# EAGLE board Avionics-Test (EAGLE 9.6.2), part 1 of 2
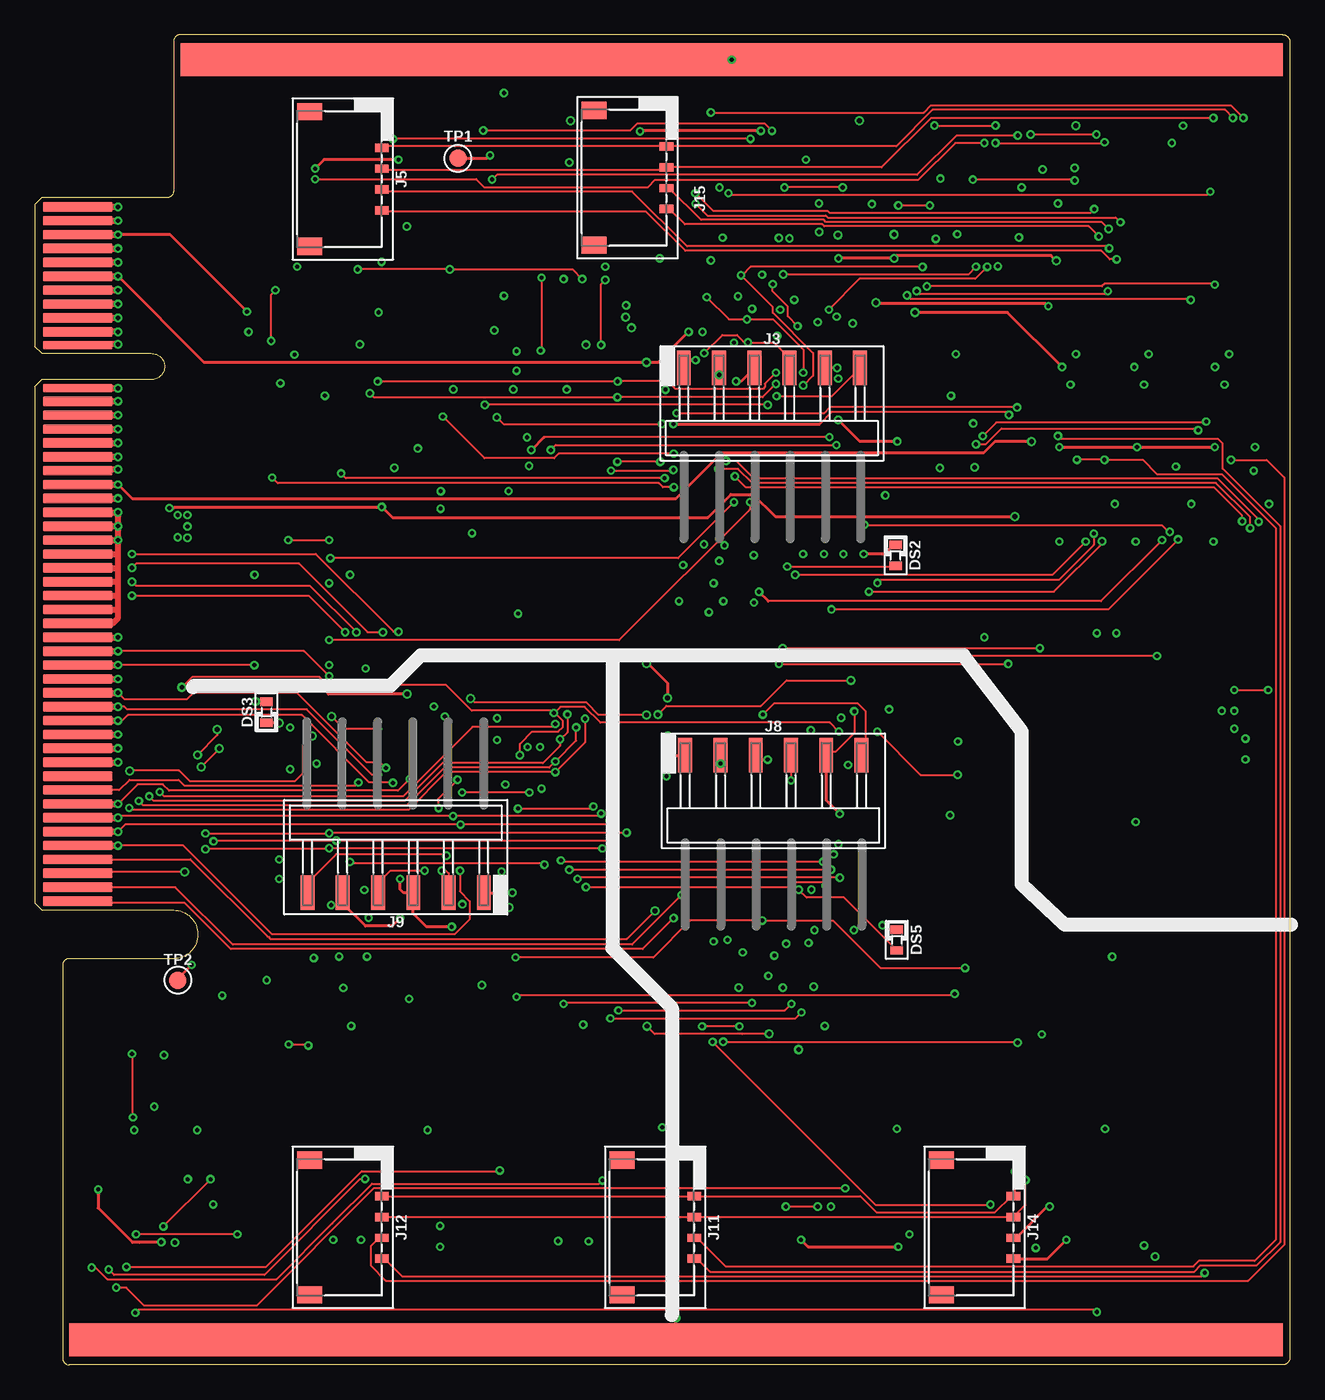
[diagram p14: board, top side]
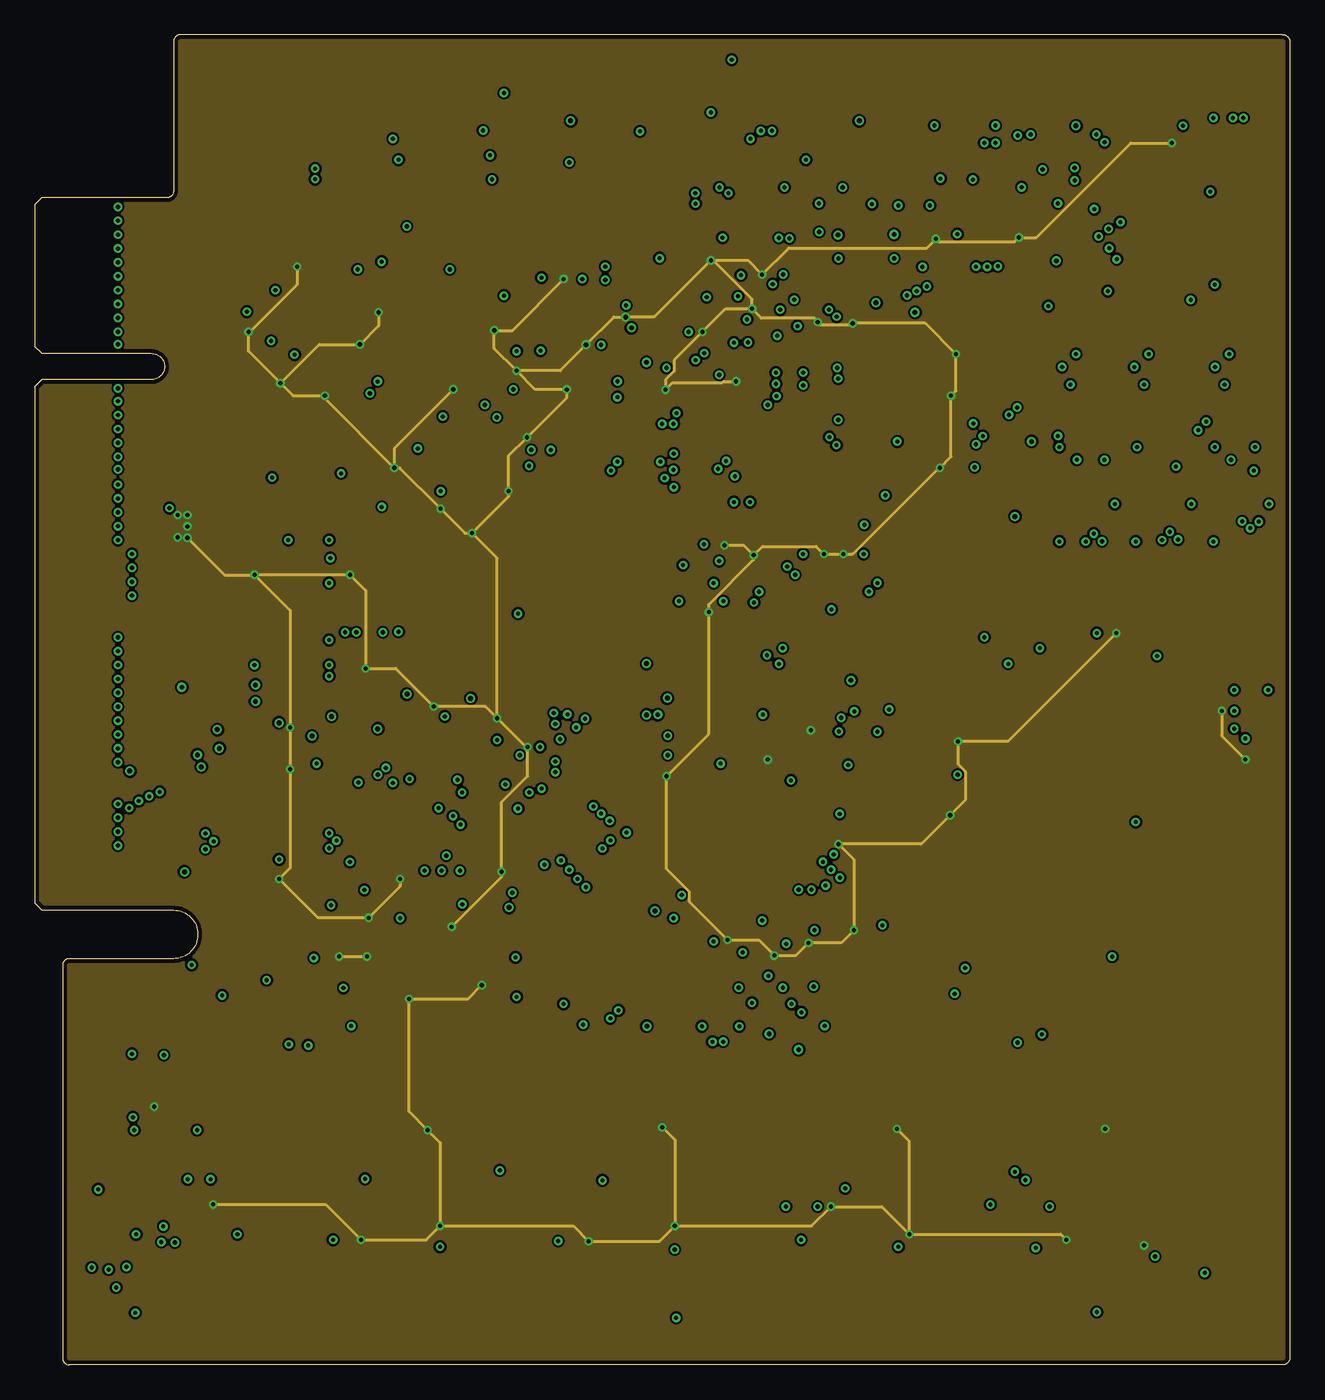
[diagram p15: board, inner layer Route2]
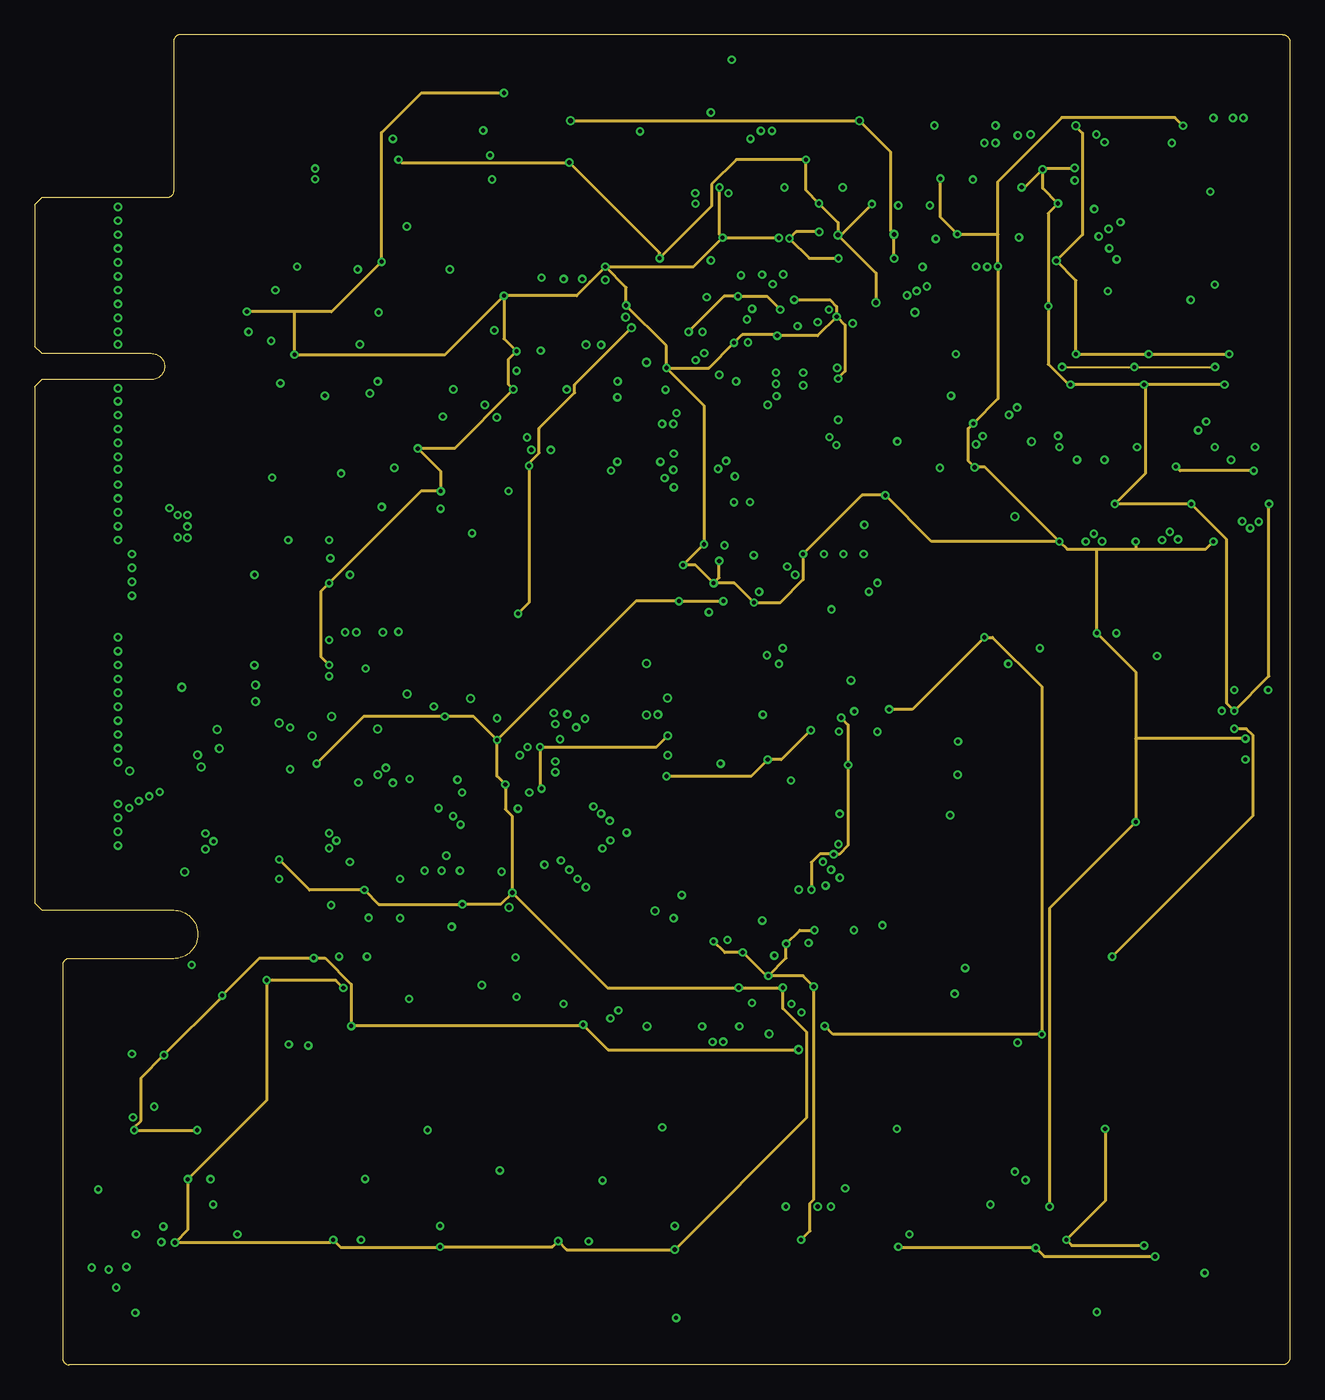
[diagram p16: board, inner layer Route15]
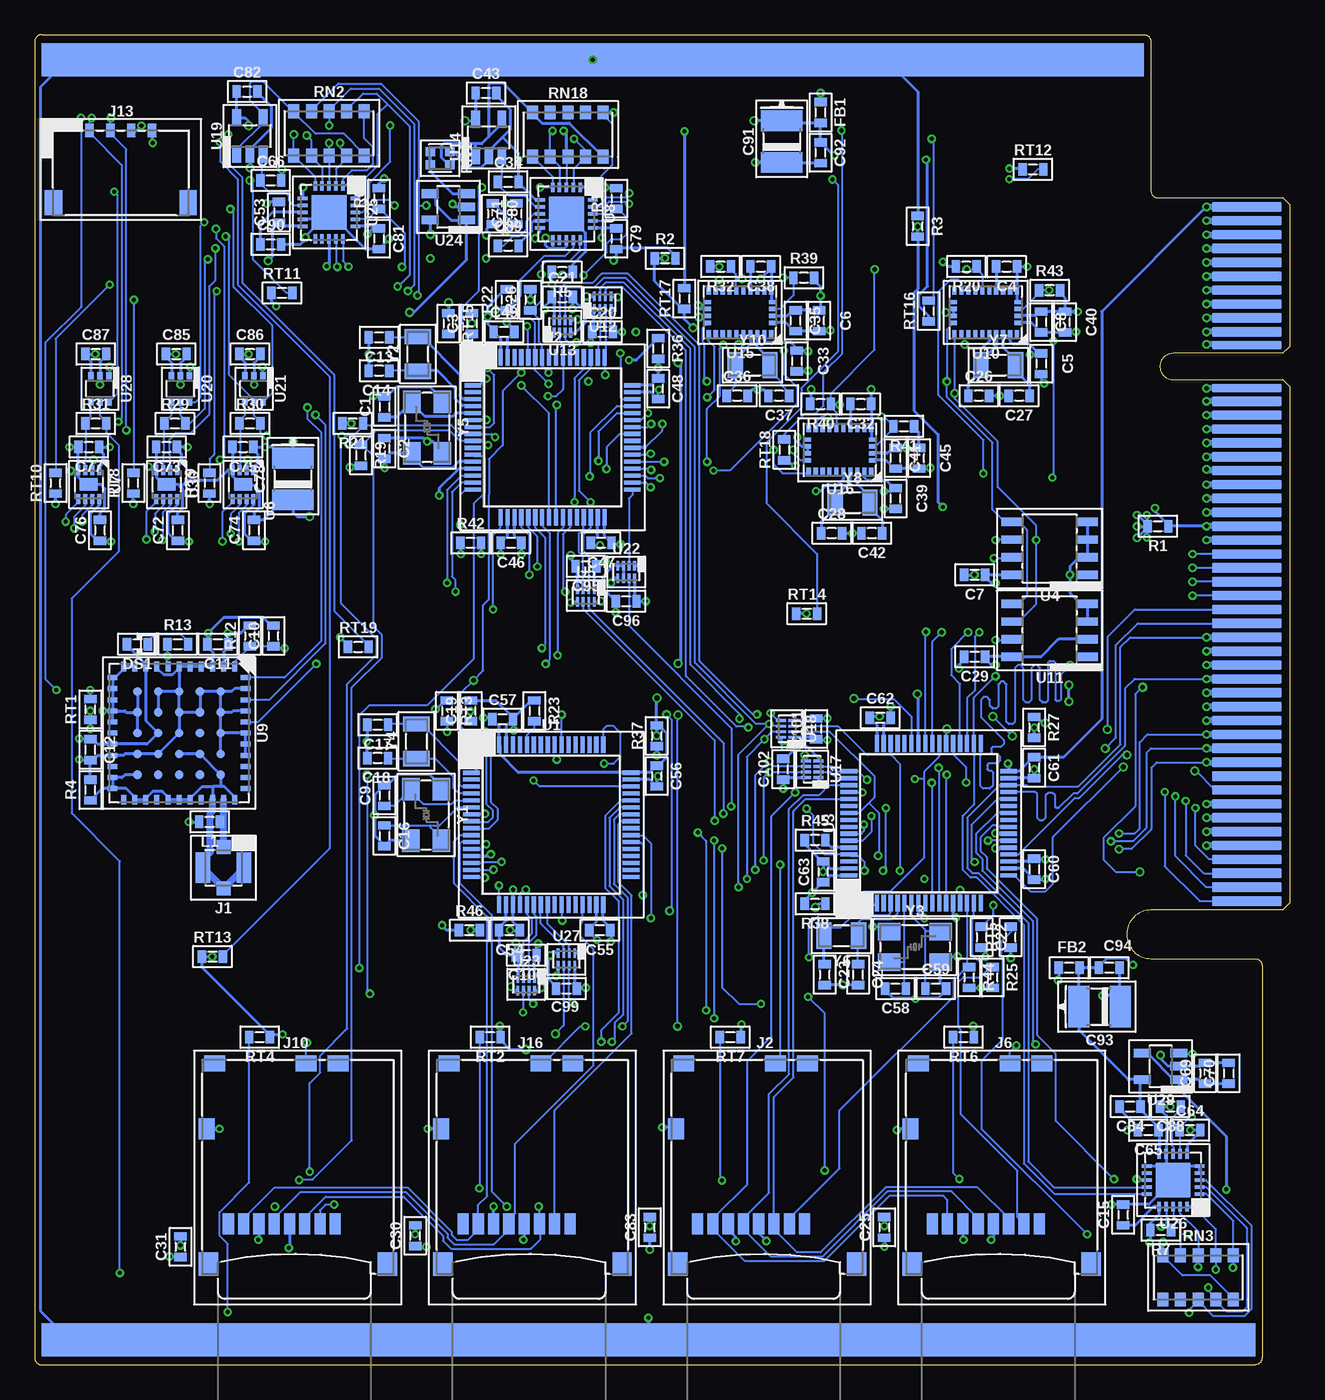
[diagram p17: board, bottom side, seen from below]

Size 90.4 x 95.8 mm. Coordinates in mm from the lower left corner, seen from the top.
Copper layers (1+2*15+16): Top 0.035mm / dielectric 1.6mm / Route2 0.035mm / dielectric 1.2mm / Route15 0.035mm / dielectric 0.2mm / Bottom 0.035mm
Design rules "CougsInSpace *": minimum track width 0.16mm, minimum drill 0.3mm, track to track 0.16mm, track to pad 0.16mm, pad to pad 0.16mm, via to via 0.16mm, smd to smd 0mil, copper to edge 0.3mm, drill to drill 0.3mm, minimum pad ring 0.15mm, minimum via ring 0.15mm, stop-mask expansion 0mil, vias tented up to drill 1mm, thermal gap 0.25mm
Net classes: 1 Power: width 0.2 mm

## Footprints (pad centres in the part's own frame; a part is rotated, then mirrored left to right if it is on the bottom)
1608 = smd 0.6 x 0.9: 1 -0.75,0; 2 0.75,0
4028-POL = smd 1.5 x 3: A 1.5,0; C -1.5,0
1608-POL = smd 0.6 x 0.9: A 0.75,0; C -0.75,0
U.FL = smd 1 x 1: CENTER 0,-1.5; SHIELD@2 0,1.5 | smd 1.05 x 2.2: SHIELD@1 -1.475,0; SHIELD@13 1.475,0
µSD-PUSH-PUSH = smd 0.8 x 1.5: CD/DAT3 5.55,-3.75; CLK 8.85,-3.75; CMD 6.65,-3.75; DAT0 11.05,-3.75; DAT1 12.15,-3.75; DAT2 4.45,-3.75; VDD 7.75,-3.75; VSS 9.95,-3.75 | smd 1.4 x 1.7: SHELL@1 0.7,-0.85; SHELL@2 13.6,-0.85 | smd 1.5 x 1.15: SHELL@3 4.25,-15.325; SHELL@4 13.15,-15.325; SW 6.55,-15.325 | smd 1.15 x 1.5: SW-LEVER 13.725,-10.6
SMD2.54-1X06-R = smd 1 x 2.5: 1 6.35,-5; 2 3.81,-5; 3 1.27,-5; 4 -1.27,-5; 5 -3.81,-5; 6 -6.35,-5
CARD-FULL = smd 5 x 0.7 bottom: A1 3.1,35.5; A2 3.1,34.5; A3 3.1,33.5; A4 3.1,32.5; A5 3.1,31.5; A6 3.1,30.5; A7 3.1,29.5; A8 3.1,28.5; A9 3.1,27.5; A10 3.1,26.5; A13 3.1,21.5; A14 3.1,20.5; A15 3.1,19.5; A16 3.1,18.5; A17 3.1,17.5; A18 3.1,16.5; A19 3.1,15.5; A20 3.1,14.5; A21 3.1,13.5; A22 3.1,12.5; A23 3.1,11.5; A24 3.1,10.5; A25 3.1,9.5; A26 3.1,8.5; A27 3.1,7.5; A28 3.1,6.5; A29 3.1,5.5; A30 3.1,4.5; A31 3.1,3.5; A32 3.1,2.5; A33 3.1,1.5; A34 3.1,0.5; A35 3.1,-0.5; A36 3.1,-1.5; A37 3.1,-2.5; A38 3.1,-3.5; A39 3.1,-4.5; A40 3.1,-5.5; A41 3.1,-6.5; A42 3.1,-7.5; A43 3.1,-8.5; A44 3.1,-9.5; A45 3.1,-10.5; A46 3.1,-11.5; A47 3.1,-12.5; A48 3.1,-13.5; A49 3.1,-14.5 | smd 5 x 0.6 bottom: A11 3.1,25.55; A12 3.1,22.45 | smd 5 x 0.7: B1 3.1,35.5; B2 3.1,34.5; B3 3.1,33.5; B4 3.1,32.5; B5 3.1,31.5; B6 3.1,30.5; B7 3.1,29.5; B8 3.1,28.5; B9 3.1,27.5; B10 3.1,26.5; B13 3.1,21.5; B14 3.1,20.5; B15 3.1,19.5; B16 3.1,18.5; B17 3.1,17.5; B18 3.1,16.5; B19 3.1,15.5; B20 3.1,14.5; B21 3.1,13.5; B22 3.1,12.5; B23 3.1,11.5; B24 3.1,10.5; B25 3.1,9.5; B26 3.1,8.5; B27 3.1,7.5; B28 3.1,6.5; B29 3.1,5.5; B30 3.1,4.5; B31 3.1,3.5; B32 3.1,2.5; B33 3.1,1.5; B34 3.1,0.5; B35 3.1,-0.5; B36 3.1,-1.5; B37 3.1,-2.5; B38 3.1,-3.5; B39 3.1,-4.5; B40 3.1,-5.5; B41 3.1,-6.5; B42 3.1,-7.5; B43 3.1,-8.5; B44 3.1,-9.5; B45 3.1,-10.5; B46 3.1,-11.5; B47 3.1,-12.5; B48 3.1,-13.5; B49 3.1,-14.5 | smd 5 x 0.6: B11 3.1,25.55; B12 3.1,22.45 | smd 79.4 x 2.4 bottom: CHASSIS@1 50.2,46.1 | smd 79.4 x 2.4: CHASSIS@2 50.2,46.1 | smd 87.4 x 2.4 bottom: CHASSIS@3 46.2,-46.1 | smd 87.4 x 2.4: CHASSIS@4 46.2,-46.1
PICOLOCK1.5-04 = smd 0.6 x 1: 1 2.25,0; 2 0.75,0; 3 -0.75,0; 4 -2.25,0 | smd 1.25 x 1.8: PAD@1 4.855,5.2; PAD@2 -4.855,5.2
1616 = smd 0.64 x 0.7: 1 -0.47,-0.7; 2 0.47,-0.7; 3 0.47,0.7; 4 -0.47,0.7
3264 = smd 0.79 x 1: 1 -2.54,-1.6; 2 -1.27,-1.6; 3 0,-1.6; 4 1.27,-1.6; 5 2.54,-1.6; 6 2.54,1.6; 7 1.27,1.6; 8 0,1.6; 9 -1.27,1.6; 10 -2.54,1.6
SMD-C-1.25 = smd 1.25 x 1.25: 1 0,0
QFP-64-1010 = smd 1.2 x 0.3: 1 -5.75,3.75; 2 -5.75,3.25; 3 -5.75,2.75; 4 -5.75,2.25; 5 -5.75,1.75; 6 -5.75,1.25; 7 -5.75,0.75; 8 -5.75,0.25; 9 -5.75,-0.25; 10 -5.75,-0.75; 11 -5.75,-1.25; 12 -5.75,-1.75; 13 -5.75,-2.25; 14 -5.75,-2.75; 15 -5.75,-3.25; 16 -5.75,-3.75; 33 5.75,-3.75; 34 5.75,-3.25; 35 5.75,-2.75; 36 5.75,-2.25; 37 5.75,-1.75; 38 5.75,-1.25; 39 5.75,-0.75; 40 5.75,-0.25; 41 5.75,0.25; 42 5.75,0.75; 43 5.75,1.25; 44 5.75,1.75; 45 5.75,2.25; 46 5.75,2.75; 47 5.75,3.25; 48 5.75,3.75 | smd 0.3 x 1.2: 17 -3.75,-5.75; 18 -3.25,-5.75; 19 -2.75,-5.75; 20 -2.25,-5.75; 21 -1.75,-5.75; 22 -1.25,-5.75; 23 -0.75,-5.75; 24 -0.25,-5.75; 25 0.25,-5.75; 26 0.75,-5.75; 27 1.25,-5.75; 28 1.75,-5.75; 29 2.25,-5.75; 30 2.75,-5.75; 31 3.25,-5.75; 32 3.75,-5.75; 49 3.75,5.75; 50 3.25,5.75; 51 2.75,5.75; 52 2.25,5.75; 53 1.75,5.75; 54 1.25,5.75; 55 0.75,5.75; 56 0.25,5.75; 57 -0.25,5.75; 58 -0.75,5.75; 59 -1.25,5.75; 60 -1.75,5.75; 61 -2.25,5.75; 62 -2.75,5.75; 63 -3.25,5.75; 64 -3.75,5.75
SO8 = smd 1.55 x 0.6: 1 -2.7,1.905; 2 -2.7,0.635; 3 -2.7,-0.635; 4 -2.7,-1.905; 5 2.7,-1.905; 6 2.7,-0.635; 7 2.7,0.635; 8 2.7,1.905
X2SON-8 = smd 0.2 x 0.7: 1 0.6,0.45; 2 0.2,0.45; 3 -0.2,0.45; 4 -0.6,0.45; 5 -0.6,-0.45; 6 -0.2,-0.45; 7 0.2,-0.45; 8 0.6,-0.45
WSON-8 = smd 0.7 x 0.29: 1 -1.05,0.75; 2 -1.05,0.25; 3 -1.05,-0.25; 4 -1.05,-0.75; 5 1.05,-0.75; 6 1.05,-0.25; 7 1.05,0.25; 8 1.05,0.75 | smd 0.9 x 1.3: PAD 0,0
QFN-20-4040 = smd 0.7 x 0.25: 1 -1.9,1; 2 -1.9,0.5; 3 -1.9,0; 4 -1.9,-0.5; 5 -1.9,-1; 11 1.9,-1; 12 1.9,-0.5; 13 1.9,0; 14 1.9,0.5; 15 1.9,1 | smd 0.25 x 0.7: 6 -1,-1.9; 7 -0.5,-1.9; 8 0,-1.9; 9 0.5,-1.9; 10 1,-1.9; 16 1,1.9; 17 0.5,1.9; 18 0,1.9; 19 -0.5,1.9; 20 -1,1.9 | smd 2.5 x 2.5: PAD 0,0
VENUS-1010 = smd 0.7 x 0.36: 1 -4.8,4; 2 -4.8,3.2; 3 -4.8,2.4; 4 -4.8,1.6; 5 -4.8,0.8; 6 -4.8,0; 7 -4.8,-0.8; 8 -4.8,-1.6; 9 -4.8,-2.4; 10 -4.8,-3.2; 11 -4.8,-4; 23 4.8,-4; 24 4.8,-3.2; 25 4.8,-2.4; 26 4.8,-1.6; 27 4.8,-0.8; 28 4.8,0; 29 4.8,0.8; 30 4.8,1.6; 31 4.8,2.4; 32 4.8,3.2; 33 4.8,4 | smd 0.36 x 0.7: 12 -4,-4.8; 13 -3.2,-4.8; 14 -2.4,-4.8; 15 -1.6,-4.8; 16 -0.8,-4.8; 17 0,-4.8; 18 0.8,-4.8; 19 1.6,-4.8; 20 2.4,-4.8; 21 3.2,-4.8; 22 4,-4.8; 34 4,4.8; 35 3.2,4.8; 36 2.4,4.8; 37 1.6,4.8; 38 0.8,4.8; 39 0,4.8; 40 -0.8,4.8; 41 -1.6,4.8; 42 -2.4,4.8; 43 -3.2,4.8; 44 -4,4.8 | smd 0.6 x 0.6: 45 -3,3; 46 -3,1.5; 47 -3,0; 48 -3,-1.5; 49 -3,-3; 50 -1.5,3; 51 -1.5,1.5; 52 -1.5,0; 53 -1.5,-1.5; 54 -1.5,-3; 55 0,3; 56 0,1.5; 57 0,0; 58 0,-1.5; 59 0,-3; 60 1.5,3; 61 1.5,1.5; 62 1.5,0; 63 1.5,-1.5; 64 1.5,-3; 65 3,3; 66 3,1.5; 67 3,0; 68 3,-1.5; 69 3,-3
LGA-28-4050 = smd 0.3 x 0.575: 1 -2.25,1.562; 6 -2.25,-1.562; 7 -1.75,-1.562; 8 -1.25,-1.562; 9 -0.75,-1.562; 10 -0.25,-1.562; 11 0.25,-1.562; 12 0.75,-1.562; 13 1.25,-1.562; 14 1.75,-1.562; 15 2.25,-1.562; 20 2.25,1.562; 21 1.75,1.562; 22 1.25,1.562; 23 0.75,1.562; 24 0.25,1.562; 25 -0.25,1.562; 26 -0.75,1.562; 27 -1.25,1.562; 28 -1.75,1.562 | smd 0.475 x 0.3: 2 -2.312,0.75; 3 -2.312,0.25; 4 -2.312,-0.25; 5 -2.312,-0.75; 16 2.312,-0.75; 17 2.312,-0.25; 18 2.312,0.25; 19 2.312,0.75
SOT23-5 = smd 1.22 x 0.62: 1 -1.31,0.95; 2 -1.31,0; 3 -1.31,-0.95; 4 1.31,-0.95; 5 1.31,0.95
SOT363 = smd 0.5 x 0.4: 1 -0.95,0.65; 2 -0.95,0; 3 -0.95,-0.65; 4 0.95,-0.65; 5 0.95,0; 6 0.95,0.65
SMD-5032 = smd 1.6 x 1.25: 1 -1.85,-1.1; 2 1.85,-1.1; 3 1.85,1.1; 4 -1.85,1.1
SMD-3215 = smd 1.1 x 1.9: 1 -1.25,0; 2 1.25,0

## Placement (x,y rotation side)
C1  10pF 5%  [1608]  65.2,69 90 bottom
C2  10pF 5%  [1608]  65.2,66 270 bottom
C3  10nF 10%  [1608]  58.9,75 90 bottom
C4  100nF 10%  [1608]  20.4,79.1 180 bottom
C5  100nF 10%  [1608]  17.89,72.1 270 bottom
C6  100nF 10%  [1608]  33.9,75.2 270 bottom
C7  100nF 10%  [1608]  22.7,56.9 180 bottom
C8  6.8nF 5%  [1608]  17.9,75.1 270 bottom
C9  10pF 5%  [1608]  65.2,41 90 bottom
C10  1µF 10%  [1608]  73.2,52.5 90 bottom
C11  100nF 10%  [1608]  77.2,51.9 180 bottom
C12  100nF 10%  [1608]  86.4,44.3 270 bottom
C13  15pF 1%  [1608]  65.6,74 180 bottom
C14  15pF 1%  [1608]  65.6,71.6 180 bottom
C15  100nF 10%  [1608]  12,10.8 90 bottom
C16  10pF 5%  [1608]  65.2,38.1 270 bottom
C17  15pF 1%  [1608]  65.7,46.1 180 bottom
C18  15pF 1%  [1608]  65.7,43.7 180 bottom
C19  10nF 10%  [1608]  59,47.1 90 bottom
C20  100nF 10%  [1608]  49.5,74.4 0 bottom
C21  100nF 10%  [1608]  52.4,76.9 0 bottom
C22  10nF 10%  [1608]  22.2,30.8 270 bottom
C23  15pF 1%  [1608]  33.5,28.1 270 bottom
C24  15pF 1%  [1608]  31.1,28.1 270 bottom
C25  100nF 10%  [1608]  29.2,9.9 90 bottom
C26  15pF 1%  [1608]  22.4,69.8 0 bottom
C27  15pF 1%  [1608]  19.5,69.8 180 bottom
C28  15pF 1%  [1608]  33,59.9 0 bottom
C29  100nF 10%  [1608]  22.7,51 180 bottom
C30  100nF 10%  [1608]  63,9.3 90 bottom
C31  100nF 10%  [1608]  79.9,8.5 90 bottom
C32  100nF 10%  [1608]  30.9,69.2 180 bottom
C33  100nF 10%  [1608]  35.5,72.3 270 bottom
C34  10µF 10%  [1608]  56.3,85.2 0 bottom
C35  6.8nF 5%  [1608]  35.6,75.2 270 bottom
C36  15pF 1%  [1608]  39.8,69.8 0 bottom
C37  15pF 1%  [1608]  36.8,69.8 180 bottom
C38  100nF 10%  [1608]  38.1,79.1 180 bottom
C39  100nF 10%  [1608]  28.4,62.4 270 bottom
C40  100nF 10%  [1608]  16.2,75.1 270 bottom
C41  6.8nF 5%  [1608]  28.4,65.3 270 bottom
C42  15pF 1%  [1608]  30.1,59.9 180 bottom
C43  100nF 10%  [1608]  57.9,91.6 0 bottom
C45  100nF 10%  [1608]  26.7,65.3 270 bottom
C46  100nF 10%  [1608]  56.1,59.2 180 bottom
C47  100nF 10%  [1608]  49.6,59.2 180 bottom
C48  100nF 10%  [1608]  45.5,70.3 270 bottom
C49  100nF 10%  [1608]  56.6,74.4 0 bottom
C53  100nF 10%  [1608]  72.8,83 90 bottom
C54  100nF 10%  [1608]  56.2,31.3 180 bottom
C55  100nF 10%  [1608]  49.7,31.3 180 bottom
C56  100nF 10%  [1608]  45.6,42.4 270 bottom
C57  100nF 10%  [1608]  56.7,46.5 0 bottom
C58  10pF 5%  [1608]  28.4,27.1 180 bottom
C59  10pF 5%  [1608]  25.5,27.1 0 bottom
C60  100nF 10%  [1608]  18.4,35.7 270 bottom
C61  100nF 10%  [1608]  18.4,43 270 bottom
C62  100nF 10%  [1608]  29.5,46.6 0 bottom
C63  100nF 10%  [1608]  33.6,35.5 90 bottom
C64  10µF 10%  [1608]  7.2,16.9 0 bottom
C65  100nF 10%  [1608]  10.2,16.9 180 bottom
C66  10µF 10%  [1608]  73.4,85.3 0 bottom
C69  1µF 10%  [1608]  6.1,21 90 bottom
C70  100nF 10%  [1608]  4.4,21 90 bottom
C71  100nF 10%  [1608]  55.7,82.9 90 bottom
C72  100nF 10%  [1608]  80.1,60.1 90 bottom
C73  100nF 10%  [1608]  80.9,66.1 180 bottom
C74  100nF 10%  [1608]  74.6,60.1 90 bottom
C75  100nF 10%  [1608]  75.4,66.1 180 bottom
C76  100nF 10%  [1608]  85.7,60.1 90 bottom
C77  100nF 10%  [1608]  86.5,66.1 180 bottom
C78  47µF  [4028-POL]  71.8,63.8 90 bottom
C79  100nF 10%  [1608]  48.5,81.1 270 bottom
C80  100nF 10%  [1608]  57.4,82.9 270 bottom
C81  100nF 10%  [1608]  65.6,81.1 270 bottom
C82  100nF 10%  [1608]  75.1,91.7 0 bottom
C83  100nF 10%  [1608]  46.1,9.9 90 bottom
C84  100nF 10%  [1608]  11.5,18.6 180 bottom
C85  100nF 10%  [1608]  80.2,72.8 0 bottom
C86  100nF 10%  [1608]  74.9,72.8 0 bottom
C87  100nF 10%  [1608]  86,72.8 0 bottom
C88  1µF 10%  [1608]  8.6,18.6 180 bottom
C89  1µF 10%  [1608]  56.3,80.6 0 bottom
C90  1µF 10%  [1608]  73.4,80.7 0 bottom
C91  4.7µF 10%  [4028-POL]  36.6,88.1 90 bottom
C92  100nF 10%  [1608]  33.8,87.3 270 bottom
C93  4.7µF 10%  [4028-POL]  13.7,25.8 180 bottom
C94  100nF 10%  [1608]  13,28.6 0 bottom
C95  100nF 10%  [1608]  50.7,57.5 180 bottom
C96  100nF 10%  [1608]  47.8,55 180 bottom
C99  100nF 10%  [1608]  52.1,27.1 180 bottom
C100  100nF 10%  [1608]  55,29.5 180 bottom
C101  100nF 10%  [1608]  34.1,45.8 90 bottom
C102  100nF 10%  [1608]  36.5,42.9 90 bottom
DS1  Green  [1608-POL]  83,51.9 180 bottom
DS2  Blue  [1608-POL]  62,58.3 270 top
DS3  Yellow  [1608-POL]  16.7,47 90 top
DS5  Green  [1608-POL]  62.1,30.6 270 top
FB1  1.5kΩ @ 100MHz  [1608]  33.8,90.2 270 bottom
FB2  1.5kΩ @ 100MHz  [1608]  15.9,28.6 0 bottom
J1  +X Panel GPS  [U.FL]  76.8,35.8 180 bottom
J2  IHU SD1  [µSD-PUSH-PUSH]  30.5,6.4 180 bottom
J3  SWD  [SMD2.54-1X06-R]  53.1,66.8 180 top
J4  CougSat Card  [CARD-FULL]  0,47.9 0 top
J5  -X  [PICOLOCK1.5-04]  25,85.4 90 top
J6  IHU SD0  [µSD-PUSH-PUSH]  13.6,6.4 180 bottom
J8  SWD  [SMD2.54-1X06-R]  53.2,38.9 180 top
J9  SWD  [SMD2.54-1X06-R]  26,39 0 top
J10  iFJR SD1  [µSD-PUSH-PUSH]  64.3,6.4 180 bottom
J11  -Y  [PICOLOCK1.5-04]  47.5,9.9 90 top
J12  +Z  [PICOLOCK1.5-04]  25,9.9 90 top
J13  +X  [PICOLOCK1.5-04]  84.2,88.9 180 bottom
J14  -Z  [PICOLOCK1.5-04]  70.5,9.9 90 top
J15  +Y  [PICOLOCK1.5-04]  45.5,85.5 90 top
J16  IFJR SD0  [µSD-PUSH-PUSH]  47.4,6.4 180 bottom
L1  33nH 2%  [1608]  77.8,39.1 180 bottom
R1  0Ω <20mΩ  [1608]  9.5,60.4 180 bottom
R2  0Ω <20mΩ  [1608]  45,79.7 0 bottom
R3  0Ω <20mΩ  [1608]  26.8,82 270 bottom
R4  0Ω <20mΩ  [1608]  86.4,41.4 90 bottom
R5  0Ω <20mΩ  [1608]  52.4,78.7 180 bottom
R6  10kΩ 0.1%  [1608]  65.6,84 90 bottom
R7  10kΩ 0.1%  [1608]  9.3,9.7 180 bottom
R12  10kΩ 0.1%  [1608]  74.9,52.5 90 bottom
R13  1kΩ 0.1%  [1608]  80.1,51.9 0 bottom
R17  10kΩ 0.1%  [1608]  48.5,84 90 bottom
R19  1kΩ 0.1%  [1608]  66.9,65.5 270 bottom
R20  10kΩ 0.1%  [1608]  23.3,79.1 180 bottom
R21  1kΩ 0.1%  [1608]  67.5,67.8 180 bottom
R22  1kΩ 0.1%  [1608]  56.41,76.71 90 bottom
R23  0Ω <20mΩ  [1608]  54.4,47.1 270 bottom
R25  10kΩ 0.1%  [1608]  21.4,27.9 270 bottom
R26  1kΩ 0.1%  [1608]  54.7,76.7 90 bottom
R27  1kΩ 0.1%  [1608]  18.41,45.91 270 bottom
R29  50mΩ 1%  [1608]  80.3,67.8 0 bottom
R30  50mΩ 1%  [1608]  74.9,67.8 0 bottom
R31  50mΩ 1%  [1608]  86,67.8 0 bottom
R32  10kΩ 0.1%  [1608]  41,79.1 180 bottom
R36  1kΩ 0.1%  [1608]  45.5,73.2 270 bottom
R37  1kΩ 0.1%  [1608]  45.6,45.3 90 bottom
R38  1kΩ 0.1%  [1608]  34.2,33.2 180 bottom
R39  10kΩ 0.1%  [1608]  35,78.3 0 bottom
R40  10kΩ 0.1%  [1608]  33.8,69.2 180 bottom
R41  10kΩ 0.1%  [1608]  27.8,67.6 180 bottom
R42  1kΩ 0.1%  [1608]  59,59.2 0 bottom
R43  10kΩ 0.1%  [1608]  17.3,77.4 0 bottom
R44  10kΩ 0.1%  [1608]  23.1,27.9 270 bottom
R45  0Ω <20mΩ  [1608]  34.2,37.8 0 bottom
R46  1kΩ 0.1%  [1608]  59.1,31.3 0 bottom
RN1  20kΩ 0.1%  [1616]  61.2,86.9 270 bottom
RN2  10kΩ 5%  [3264]  69.2,88.7 0 bottom
RN3  10kΩ 5%  [3264]  6.6,6.3 0 bottom
RN18  10kΩ 5%  [3264]  52,88.6 0 bottom
RT1  10kΩ 5%  [1608]  86.4,47.2 90 bottom
RT2  10kΩ 5%  [1608]  57.6,23.6 180 bottom
RT3  10kΩ 5%  [1608]  60.7,47.1 270 bottom
RT4  10kΩ 5%  [1608]  74.2,23.6 180 bottom
RT5  10kΩ 5%  [1608]  20.1,30.8 90 bottom
RT6  10kΩ 5%  [1608]  23.5,23.6 180 bottom
RT7  10kΩ 5%  [1608]  40.3,23.6 180 bottom
RT8  10kΩ 5%  [1608]  83.3,63.5 90 bottom
RT9  10kΩ 5%  [1608]  77.8,63.5 90 bottom
RT10  10kΩ 5%  [1608]  88.9,63.5 90 bottom
RT11  10kΩ 5%  [1608]  72.6,77.2 0 bottom
RT12  10kΩ 5%  [1608]  18.5,86.1 0 bottom
RT13  10kΩ 5%  [1608]  77.6,29.4 0 bottom
RT14  10kΩ 5%  [1608]  34.8,54.1 0 bottom
RT15  10kΩ 5%  [1608]  60.6,75 270 bottom
RT16  10kΩ 5%  [1608]  26,75.9 90 bottom
RT17  10kΩ 5%  [1608]  43.6,76.8 90 bottom
RT18  10kΩ 5%  [1608]  36.4,65.9 90 bottom
RT19  10kΩ 5%  [1608]  67.1,51.7 0 bottom
TP1  TEST_POINT-SMD-C-1.25  [SMD-C-1.25]  30.48,86.89 0 top
TP2  TEST_POINT-SMD-C-1.25  [SMD-C-1.25]  10.3,27.7 0 top
U1  STM32L476RGT  [QFP-64-1010]  53.2,38.9 0 bottom
U2  STM32L476RGT  [QFP-64-1010]  53.1,66.8 0 bottom
U3  STM32L476RGT  [QFP-64-1010]  26,39 90 bottom
U4  M24M01  [SO8]  17.3,58.8 180 bottom
U5  TXS0102DQM  [X2SON-8]  50.7,55.4 0 bottom
U6  DRV8837  [WSON-8]  75.4,63.4 270 bottom
U7  DRV8837  [WSON-8]  86.5,63.4 270 bottom
U8  AD7291  [QFN-20-4040]  52.1,82.9 270 bottom
U9  Venus838FLPx-L  [VENUS-1010]  80,45.5 270 bottom
U10  BNO055  [LGA-28-4050]  21.9,75.8 180 bottom
U11  M24M01  [SO8]  17.3,52.9 180 bottom
U12  TXS0102DQM  [X2SON-8]  49.5,76.5 180 bottom
U13  TXS0102DQM  [X2SON-8]  52.4,74.8 180 bottom
U14  AD8515  [SOT23-5]  57.7,88.4 90 bottom
U15  BNO055  [LGA-28-4050]  39.6,75.8 180 bottom
U16  BNO055  [LGA-28-4050]  32.4,65.9 180 bottom
U17  TXS0102DQM  [X2SON-8]  34.4,42.9 270 bottom
U18  TXS0102DQM  [X2SON-8]  36.2,45.8 270 bottom
U19  AD8515  [SOT23-5]  74.9,88.5 90 bottom
U20  INA199C2  [SOT363]  79.9,70.3 270 bottom
U21  INA199C2  [SOT363]  74.6,70.3 270 bottom
U22  TXS0102DQM  [X2SON-8]  47.8,57.1 0 bottom
U23  TXS0102DQM  [X2SON-8]  55,27.4 0 bottom
U24  AD8515  [SOT23-5]  60.6,83.4 180 bottom
U25  AD7291  [QFN-20-4040]  69.2,83 270 bottom
U26  AD7291  [QFN-20-4040]  8.4,13.3 180 bottom
U27  TXS0102DQM  [X2SON-8]  52.1,29.2 0 bottom
U28  INA199C2  [SOT363]  85.7,70.3 270 bottom
U29  AD8515  [SOT23-5]  9.3,21.5 180 bottom
U30  DRV8837  [WSON-8]  80.9,63.4 270 bottom
Y1  8MHz ±10ppm  [SMD-5032]  62.2,39.6 270 bottom
Y2  32.768kHz ±10ppm  [SMD-3215]  62.8,72.8 90 bottom
Y3  8MHz ±10ppm  [SMD-5032]  27,30.1 0 bottom
Y4  32.768kHz ±10ppm  [SMD-3215]  62.9,44.9 90 bottom
Y5  8MHz ±10ppm  [SMD-5032]  62.14,67.5 270 bottom
Y6  32.768kHz ±10ppm  [SMD-3215]  32.3,30.9 180 bottom
Y7  32.768kHz ±10ppm  [SMD-3215]  21,72 0 bottom
Y8  32.768kHz ±10ppm  [SMD-3215]  31.5,62.1 0 bottom
Y10  32.768kHz ±10ppm  [SMD-3215]  38.7,72 0 bottom

## Tracks (layer width: path | path; a pad name or v marks a point on that pad's centre or on a via)
3.3V_0  (via drill 0.3)
  Top 0.45: J4.B1 v6,83.4
  Route15 0.2: v22.23,27.15 21.68,27.7 v16.7,27.7 16.7,19.04 v11.03,13.37 11.03,9.73 v10.1,8.8 21.3,8.8 v21.5,9 22.06,8.44 29.14,8.44 v29.2,8.5 37.29,8.5 v37.7,8.91 38.32,8.3 v46.1,8.3 55.61,17.81 55.61,23.94 53.88,25.67 v53.88,27.16 v50.71,27.16 41.24,27.16 v34.4,34 | v17.6,36.4 19.8,34.2 v23.75,34.2 24.78,33.17 v30.8,33.17 33.57,33.17 v34.4,34 | v34.4,34 34.4,39.5 33.9,40 v33.9,41.8 33.3,42.4 v33.3,45 | v33.3,45 31.6,46.7 v29.54,46.7 23.7,46.7 v20.3,43.3 | v49.6,55 v46.4,55 43.3,55 v33.3,45
  Bottom 0.2: U3.19 18.6,36.25 C60.1 17.65,36.45 v17.6,36.4 | U27.8 51.5,27.25 C99.1 51.29,27.16 v50.71,27.16 | U23.8 54.1,26.95 v53.88,27.16 | U3.64 33.1,35.25 C63.1 33.66,34.75 v34.4,34 34.95,33.45 R38.2 | U18.1 34.25,45.2 C101.1 34.05,45 v33.3,45 | U17.1 33.95,41.85 v33.9,41.8 | U3.48 29.75,46.1 C62.1 30.15,46.7 v29.54,46.7 | U22.8 47.2,55.15 C96.1 v46.4,55 | U5.8 49.65,54.95 v49.6,55 | C15.1 11.14,10.05 9.79,11.4 U26.16 9.4,10.85 10.05,10.2 R7.2 10.05,8.85 v10.1,8.8 | U26.13 10.96,13.3 v11.03,13.37 | J6.VDD 21.35,9.15 v21.5,9 | FB2.1 16.65,27.75 v16.7,27.7 | R25.2 v22.23,27.15 R44.2 | C25.1 v29.2,8.5 | v37.7,8.91 38.25,9.46 J2.VDD | v46.1,8.3 C83.1 | U3.13 v23.75,34.2 | v30.8,33.17 29.83,33.17 U3.1 | v20.3,43.3 20.25,43.25 U3.32 19.5,42.75 18.5,43.75 C61.1 16.3,43.75 13.54,46.5 13.54,75.85 v6,83.4
  Bottom 0.45: v6,83.4 J4.B1
3.3V_2  (via drill 0.3)
  Top 0.2: J14.3 70.69,9.15 72.94,11.4 v73.1,11.4 | v15.29,75.85 9.74,81.4 v6,81.4
  Top 0.45: J4.B3 v6,81.4
  Route15 0.2: 79.3,45.1 79.3,49.9 v76.5,52.7 76.5,58.74 | 79.3,45.1 v79.3,39.1 v79.3,39.09 73.1,32.89 v73.1,11.4 | v87.2,45.1 79.3,45.1 | v73.8,59.3 v73.81,59.3 74.37,58.74 76.5,58.74 | 76.5,58.74 79.3,58.74 | 79.3,58.74 84.34,58.74 v84.9,59.3 | v79.3,59.3 79.3,58.74 | v48.9,56.3 50.4,56.3 v51.8,54.9 53.7,54.9 55.34,56.54 v55.34,58.39 59.59,62.63 v61.27,62.63 64.59,59.3 v73.8,59.3 | v48.9,56.3 47.6,57.6 v46.7,57.6 v48.2,59.1 48.2,69.1 v45.5,71.8 | v45.5,71.8 48.55,71.8 v50.36,73.61 50.95,74.19 53.41,74.19 v53.48,74.12 56.4,74.12 v57.77,75.49 | v73.8,59.3 68.45,64.64 v67.7,64.64 67.24,65.1 67.24,67.43 v67.6,67.79 v67.6,67.8 69.38,69.58 v69.38,79.12 69.38,81.4 | v65.24,85.44 65.24,82.65 v66.45,81.44 69.33,81.44 69.38,81.4 | 69.38,81.4 69.38,85.23 73.97,89.82 82.14,89.82 v82.71,89.25 | v57.77,75.49 v57.76,75.5 57.76,76.23 57.28,76.71 v54.7,76.71 | v45.5,71.8 45.5,73.4 v42.6,76.3 42.6,77.6 v41.1,79.1 | v41.1,79.1 39.99,78 39.99,77.97 39.03,77 v33.8,77 | v33.8,77 33.8,73.9 v34.7,73 34.14,72.44 34.14,70.58 v34.47,70.25 34.47,70.23 30.24,66 v27.6,66 29.24,64.36 v29.24,62.92 27.82,62.92 v21.2,56.3 20.6,55.7 20.6,51 v21.2,50.4 | 18.71,75.85 21.39,75.85 v24.98,79.44 24.98,88.75 27.84,91.6 v33.8,91.6 | 18.71,75.85 v15.29,75.85 | v41.1,79.1 47.46,79.1 v49.55,81.19 | v49.55,81.19 49.32,81.41 v49.32,84.8 | v49.55,81.19 53.57,81.19 v53.59,81.16 | v57.87,71.03 57.87,71.08 58.36,71.57 58.36,74.9 v57.77,75.49 | v48.9,56.3 49.3,56.7 v49.3,57.9 | 18.71,75.85 v18.71,72.76 29.56,72.76 v33.8,77
  Bottom 0.2: v87.2,45.1 86.45,45.1 C12.1 86.2,45.05 85.85,44.7 U9.18 82.3,44.7 U9.58 82.4,46.4 U9.9 82.4,50.45 83.75,51.8 DS1.A | U9.2 76.8,51.35 76.45,51.7 C11.1 76.45,52.65 v76.5,52.7 75.55,52.7 75,53.25 R12.2 | U2.32 49.35,59.7 C47.1 48.75,59.1 v48.2,59.1 | U2.19 55.85,59.7 C46.1 v55.35,58.39 v55.34,58.39 | U2.48 46,70.55 C48.1 v45.5,71.8 R36.2 | U12.1 50.1,74.55 C20.1 50.25,73.73 v50.36,73.61 | U13.1 53.25,74.35 v53.48,74.12 | U22.5 48.75,56.65 48.9,56.5 v48.9,56.3 | U22.1 46.75,57.55 v46.7,57.6 | U5.1 50.1,57.35 C95.1 49.7,57.5 v49.3,57.9 | U5.5 51.75,54.95 v51.8,54.9 | U2.64 56.85,73.9 C49.1 57.35,74.56 57.76,74.97 57.76,75.7 | U10.3 18.3,75.55 18,75.85 C8.1 v15.29,75.85 C40.1 16.2,76.85 16.55,77.2 R43.2 | U15.3 36.2,75.55 35.8,75.95 C35.1 C6.1 33.8,76.05 v33.8,77 33.8,77.65 34.25,78.1 R39.2 | U16.3 29,65.65 28.6,66.05 C41.1 27.65,66.05 v27.6,66 26.75,66 C45.1 26.7,67.15 27.05,67.5 R41.1 | U6.8 74.64,61.92 75.31,61.26 75.31,59.86 74.8,59.35 C74.1 74.55,59.3 v73.8,59.3 | U30.8 80.15,61.92 80.81,61.26 80.81,59.96 80.2,59.35 C72.1 80.05,59.3 v79.3,59.3 | U7.8 85.75,61.92 86.41,61.26 86.41,59.86 85.9,59.35 C76.1 85.65,59.3 v84.9,59.3 | U10.28 20.16,74.23 20.16,73.74 19.93,73.51 18.75,73.51 18.09,72.85 C5.1 17.98,72.76 v18.71,72.76 | U15.28 37.84,74.23 37.84,73.84 37.61,73.61 35.91,73.61 35.5,73.2 C33.1 34.75,73.05 v34.7,73 | U16.28 30.66,64.33 30.66,63.94 30.41,63.69 29.04,63.69 28.5,63.15 | C39.1 28.5,63.15 | U4.8 C7.1 21.95,56.75 21.5,56.3 v21.2,56.3 | v79.3,39.1 L1.2 | U25.16 65.75,82 C81.1 66.04,81.85 v66.45,81.44 | R19.2 67.59,64.75 v67.7,64.64 | R21.2 v67.6,67.8
  Bottom 0.2: FB1.1 v33.8,91.6 | C79.1 48.55,81.89 49.5,81.89 | 49.5,81.89 U8.16 | U25.13 69.2,79.3 v69.38,79.12 | v65.24,85.44 65.6,85.08 R6.2 | J13.3 83.06,88.9 v82.71,89.25 | R26.2 v54.7,76.71 | 57.76,75.7 57.76,76.23 56.53,77.46 R22.2 | 57.76,75.7 57.77,75.69 v57.77,75.49 | v42.6,76.3 42.6,76.24 42.41,76.05 U15.17 | v41.1,79.1 R32.2 | 28.5,63.15 28.73,62.92 v29.24,62.92 | v21.2,50.4 21.5,50.4 21.95,50.85 C29.1 U11.8 17.93,50.99 16.66,52.27 U11.2 | R20.2 24.64,79.1 v24.98,79.44 | v49.32,84.8 48.55,84.8 R17.2 | v49.55,81.19 49.5,81.23 49.5,81.89 | U8.13 52.1,80.55 52.27,80.39 53.1,80.39 | 53.1,80.39 53.36,80.39 53.59,80.62 v53.59,81.16 | U8.11 53.1,80.39 | U2.1 58.35,70.55 v57.87,71.03 | U2.13 59.84,64.55 61.27,63.13 v61.27,62.63 | R40.2 34.47,69.28 v34.47,70.25
  Bottom 0.45: v6,81.4 J4.B3
3.3V_5  (via drill 0.3, 0.35)
  Top 0.2: v55.2,9 55.7,8.5 v62.2,8.5 | v47.1,74.4 44.9,72.2 v44.06,72.2 12.2,72.2 v6,78.4 | v45.57,48.02 45.57,49.12 44.17,50.51 v44.06,50.51
  Top 0.45: J4.B6 v6,78.4
  Route15 0.2: v80.7,7.8 72.72,7.8 v72.1,8.41 62.28,8.41 v62.2,8.5 | v55.2,9 55.84,9.64 55.84,11.63 56.11,11.9 v56.11,27.23 55.34,28.01 v52.84,28.01 | v52.84,28.01 52.69,28.01 v51,29.7 49.7,29.7 v48.9,30.5 | v52.84,28.01 54.12,29.29 v54.12,30.32 55.1,31.3 v56.16,31.3 | v55.94,34.22 55.94,36.19 56.54,36.79 57.53,36.79 v57.55,36.77 57.95,36.77 58.59,37.41 v58.59,43.2 58.59,46.1 v58.09,46.6 | v45.6,45.31 44.79,44.5 v36.4,44.5 36.4,41.6 v36.5,41.5 | v53.7,76 52.74,76.96 v50.66,76.96 49.66,76.96 v47.1,74.4
  Bottom 0.2: U1.32 49.45,32 48.95,31.5 C55.1 48.9,31.25 v48.9,30.5 | U23.1 54.4,29.35 C100.1 54.25,30.19 v54.12,30.32 | U27.5 52.7,28.15 v52.84,28.01 | U27.1 51.05,29.65 v51,29.7 | v56.11,27.23 56.11,27.16 55.9,26.95 U23.5 | U18.8 36.65,44.75 v36.4,44.5 | U17.8 36.35,42.3 C102.1 v36.5,41.5 | U13.8 53,76.75 C21.1 53.35,76.7 53.35,76.55 53.7,76.2 v53.7,76 | v50.66,76.96 50.65,76.95 U12.8 | U1.13 57.66,36.65 v57.55,36.77 | v55.94,34.22 v55.95,34.21 U1.19 55.95,31.9 55.45,31.4 C54.1 v56.16,31.3 | J16.VDD 55.15,9.05 v55.2,9 | C30.1 62.95,8.5 v62.2,8.5 | J10.VDD 72.05,8.46 v72.1,8.41 | C31.1 79.95,7.8 v80.7,7.8 | U1.1 58.59,42.65 v58.59,43.2 | v58.09,46.6 57.55,46.6 C57.1 56.95,46 U1.64 56.86,44.56 56.86,43.94 55.57,42.66 47.55,42.66 47.54,42.65 U1.48 46.1,42.65 C56.1 45.4,43.35 45.28,43.35 44.89,43.74 44.89,45.49 45.45,46.05 R37.2 | R37.2 v45.6,45.31 | R37.2 45.6,47.98 v45.57,48.02 | v44.06,50.51 43.87,50.71 43.87,72 v44.06,72.2
  Bottom 0.45: J4.B6 v6,78.4
!ADCS_ADC_RESET!  (via drill 0.3)
  Top 0.16: v55.35,70.54 56.05,71.24 56.05,72.88 53.16,75.78 53.16,76.18 v50.87,78.47 50.96,78.47 51.56,79.08 v63.94,79.08 v63.95,79.08
  Bottom 0.16: U2.24 53.35,68.53 v55.35,70.54 | v50.87,78.47 49.21,80.13 49.21,80.76 48.88,81.09 48.14,81.09 47.79,81.44 47.79,82.66 48.38,83.25 R17.1 48.6,83.25 48.87,82.98 49.45,82.4 U8.17 | 65.69,83.25 66.44,82.5 U25.17 | R6.1 65.42,83.07 65.3,83.07 63.74,81.51 63.74,79.28 v63.95,79.08
  Bottom 0.2: R6.1 65.69,83.25
!C&DH_ADC_RESET  (via drill 0.3)
  Top 0.16: v9.27,9.96 v12.66,13.37
  Bottom 0.16: U3.24 20.9,38.75 20.98,38.83 21.43,38.83 22.28,37.98 22.28,37.02 21.84,36.58 21.84,35.73 18.2,32.1 18.2,23.74 16.86,22.4 16.86,17.56 v12.66,13.37 | U26.17 8.9,10.21 8.55,9.86 R7.1 8.81,9.96 v9.27,9.96
!GPS_RESET  (via drill 0.3)
  Top 0.16: v53.87,51.61 v72.4,51.61
  Bottom 0.16: U2.22 54.35,60.29 53.63,59.57 53.63,51.85 v53.87,51.61 | v72.4,51.61 73.06,51.61 C10.1 R12.1 76,50.65 U9.1
!IMU0_BOOT_A  (via drill 0.3)
  Top 0.16: v46.04,63.21 45.24,63.21 44.95,63.49 17.51,63.49 v17.1,63.9 | v17.03,73.75 17.03,77.09 v17.34,77.4
  Bottom 0.16: 19.58,76.04 19.24,76.04 18.05,77.23 R43.1 v17.34,77.4 | U2.34 46.38,63.55 v46.04,63.21 | v17.03,73.75 17.03,63.97 v17.1,63.9
  Bottom 0.2: U10.4 19.58,76.04
!IMU1_BOOT_A  (via drill 0.3)
  Top 0.16: v36.5,78.3 36.5,73.12 v36.44,73.06 v36.44,73.05 | v41.52,64.41 45.95,64.41 v46,64.46
  Bottom 0.16: U15.4 36.73,76.05 35.75,77.03 R39.1 v36.5,78.3 | U2.36 46.14,64.56 46.04,64.46 v46,64.46 | v36.44,73.05 36.44,71.35 35.51,70.42 35.51,69.22 40.31,64.41 v41.52,64.41
  Bottom 0.2: U2.36
!IMU2_BOOT_A  (via drill 0.3)
  Top 0.16: v46.03,65.63 37.73,65.63 37.41,65.31 32.4,65.31 v29.4,68.3
  Bottom 0.16: 30.08,66.14 29.84,66.14 28.55,67.43 R41.2 29.25,68.3 v29.4,68.3 | U2.38 46.1,65.55 v46.03,65.63
  Bottom 0.2: U16.4 30.08,66.14
!IMU_RESET  (via drill 0.3)
  Top 0.16: v39.44,78.2 38.73,78.9 v29.9,78.9 v23.27,78.9 | v52.8,69.14 v32.41,69.14
  Bottom 0.16: 40.25,78.9 39.91,78.56 39.91,78.2 | 39.91,78.2 39.91,77.42 U15.11 | R40.1 33.05,69 32.65,68.6 U16.11 | v29.9,78.9 v29.91,78.89 29.91,73.1 33.05,69.96 R40.1 | v23.27,78.9 22.55,78.9 | R20.1 22.55,78.9 | 22.55,78.9 22.15,78.5 U10.11 | v39.44,78.2 39.91,78.2 | U2.25 52.85,69.09 v52.8,69.14 | R40.1 32.47,69.2 v32.41,69.14
  Bottom 0.2: R32.1 40.25,78.9
ADCS_!NRST  (via drill 0.3)
  Top 0.16: v57.8,71.8 J3.5
  Bottom 0.16: C3.1 58.9,72.9 v57.8,71.8 57.8,71.79 57.31,71.3 57.31,67.83 57.63,67.5 58.8,67.5 U2.7
ADCS_ADC0_DCAP
  Bottom 0.16: U8.8 54.45,82.89 55.01,82.34 55.01,81.75 55.47,81.29 55.95,81.29 56.64,80.6 C89.1
ADCS_ADC0_VREF
  Bottom 0.16: U14.3 56.75,85.7 57.05,85.4 C34.1 57.05,85.02 56.23,84.19 55.11,84.19 54.32,83.4 U8.7
ADCS_ADC1_DCAP
  Bottom 0.2: C90.1 74.15,82.1 73.25,83 U25.8
ADCS_ADC1_VREF
  Bottom 0.16: 74.15,85.1 73.56,84.51 72.44,84.51 72.09,84.16 72.09,83.85 71.74,83.5 U25.7 | 74.05,87.09 74.05,85.4
  Bottom 0.2: 74.15,85.1 C66.1 74.05,85.4 | U19.3 74.05,87.09
ADCS_BOOT0  (via drill 0.3 pad 0.55)
  Top 0.16: v54.95,74.81 54.24,75.52 54.24,76.22 53.15,77.31 v53.15,77.83
  Bottom 0.16: U2.60 54.85,74.72 v54.95,74.81 | v53.15,77.83 R5.2
ADCS_BUS_IRQ
  Bottom 0.16: U2.33 47.35,62.65 47.6,62.4 U22.2
ADCS_BUS_SCL
  Bottom 0.16: U2.29 50.85,60.24 51.21,59.88 51.21,58.52 50.9,58.21 U5.3
ADCS_BUS_SDA
  Bottom 0.16: U2.30 50.35,60.29 50.89,59.75 50.89,58.65 50.5,58.26 U5.2
ADCS_HALF_REF  (via drill 0.3, 0.35)
  Top 0.2: v74,71.86 70.06,75.8 v63.4,75.8
  Route15 0.16: v74,71.86 v79.2,71.86 v85.01,71.86
  Bottom 0.16: U21.1 73.95,71.81 v74,71.86 | U20.1 79.25,71.81 v79.2,71.86 | v85.01,71.86 85.05,71.83 U28.1
  Bottom 0.2: U24.4 61.61,84.35 61.51,84.25 61.51,83.55 60.41,82.45 U24.1 59.29,79.61 63.1,75.8 v63.4,75.8
ADCS_HALF_REF_UNBUFF
  Bottom 0.2: RN1.1 RN1.2 61.9,85.93 60.32,84.35 U24.3
ADCS_I2C0_SCL  (via drill 0.3)
  Top 0.16: v53.38,71.47 52.59,70.67 52.59,70.44 52.44,70.29 46.14,70.29 45.6,70.83 v41.98,70.83 v24.7,70.83 | v67.8,79.1 67.23,78.53 v53.91,78.53
  Bottom 0.16: R26.1 54.06,75.31 54.06,73.67 53.85,73.46 U2.58 53.85,71.93 v53.38,71.47 | 54.6,75.95 53.91,76.64 v53.91,78.53 53.91,79.16 53.58,79.49 51.87,79.49 51.12,80.24 51.12,80.98 | v41.98,70.83 42.19,71.04 42.19,73.57 42.26,73.64 42.26,74.7 U15.19 | U10.19 24.7,74.56 v24.7,70.83 v24.71,70.82 24.71,69.7 21.41,66.41 21.41,61.6 20.52,60.7 U4.5 19.5,60.7 18.95,60.16 18.95,55.35 19.5,54.8 U11.5 | U25.15 68.2,79.5 v67.8,79.1
  Bottom 0.2: R26.1 54.6,75.95 | 51.12,80.98 U8.15
ADCS_I2C0_SDA  (via drill 0.3)
  Top 0.16: v53.38,70.66 52.42,69.69 v41.97,69.69 24.41,69.69 v24.14,69.97 | v57.2,76 59.41,78.22 67.74,78.22 v68.61,79.08 | v18.27,59.4 v21.2,59.4
  Bottom 0.16: 51.62,80.98 51.62,80.44 52.21,79.85 53.73,79.85 55.41,78.17 55.41,76.96 R22.1 55.84,75.38 54.72,75.38 54.38,75.05 54.38,72.58 U2.59 54.35,71.6 54.33,71.6 v53.38,70.66 | v41.97,69.69 41.95,69.69 41.42,70.22 41.42,73.32 41.85,73.75 U15.20 | U10.20 24.15,74.14 24.14,74.12 v24.14,69.97 24.14,69.59 21.04,66.49 21.04,63.2 18.27,60.43 v18.27,59.4 18.27,54.8 19.53,53.53 U11.6 | U25.14 68.7,79.17 v68.61,79.08 | 56.45,76 v57.2,76 | U4.6 21.16,59.44 v21.2,59.4
  Bottom 0.2: U8.14 51.62,80.98 | U15.20 | R22.1 56.45,76
ADCS_I2C1_SCL  (via drill 0.3)
  Top 0.16: v84.38,67.93 84.31,67.86 69.26,67.86 v68.28,66.89 | v86.3,89.8 86.3,89.83 85.74,90.38 64.67,90.38 62.05,87.76 J15.1 45.41,87.75 45.41,87.76 25.11,87.76 J5.1 | v57.25,66.82 36.69,66.82 | J12.1 J11.1 59.46,12.15 60.64,10.97 69.15,10.97 70.33,12.15 J14.1 | 70.6,12.25 v70.6,13.91
  Top 0.2: 36.69,66.82 v35.77,65.9 | J14.1 70.6,12.25
  Bottom 0.16: 58.87,67.06 59.78,67.06 60.4,67.69 66.64,67.69 | R21.1 66.75,67.6 67.46,66.89 v68.28,66.89 | 86.45,88.74 84.12,86.41 84.12,68.19 v84.38,67.93 | J13.1 86.45,89.65 v86.3,89.8 | U2.8 57.48,67.05 v57.25,66.82 | U16.19 35.24,65.15 35.77,65.68 v35.77,65.9 | v70.6,13.91 70.6,20.28 69.84,21.04 69.84,22.26 67.89,24.21 67.89,49.05 65.79,51.14 65.79,52.29 68.36,54.86 68.36,66.81
  Bottom 0.2: 58.87,67.06 U2.8 | R21.1 66.64,67.69 | 86.45,88.74 J13.1 | 68.36,66.81 v68.28,66.89
ADCS_I2C1_SDA  (via drill 0.3)
  Top 0.16: v67.8,66.3 68.5,66.3 69.64,67.44 83.67,67.44 v83.8,67.31 | v84.9,89.8 64.55,89.8 61,86.25 J15.2 45.3,86.25 45.08,86.03 25.32,86.03 25.2,86.15 J5.2 | v37.17,65.89 37.53,66.25 v57.75,66.25 | J12.2 J11.2 J14.2 71.36,11.51 v71.36,13.3
  Bottom 0.16: U2.9 59.78,66.56 60.54,67.31 65.76,67.31 66.82,66.25 66,65.43 66,53.17 65.39,52.56 65.39,50.94 67.56,48.77 67.56,16.15 70.37,13.34 71.32,13.34 v71.36,13.3 | R19.1 67.75,66.25 v67.8,66.3 | v83.8,67.31 83.8,87.55 84.95,88.7 J13.2 84.95,89.75 v84.9,89.8 | v37.17,65.89 37.17,64.83 36.55,64.21 34.77,64.21 U16.20
  Bottom 0.2: U2.9 58.13,66.55 57.83,66.25 v57.75,66.25 | 66.82,66.25 R19.1
ADCS_IMU1_OSC_32_IN
  Bottom 0.16: C37.1 36.05,70 36.65,70.6 36.65,70.8 37.45,71.6 37.45,72.1
  Bottom 0.2: Y10.2 37.45,72.1 37.45,72.4 38.35,73.3 U15.27
ADCS_IMU1_OSC_32_IN1
  Bottom 0.2: U10.27 20.65,73.3 19.75,72.4 Y7.2 19.75,71.6 18.75,70.6 C27.1
ADCS_IMU1_OSC_32_IN2
  Bottom 0.2: U16.27 31.16,64.33 31.16,63.44 30.25,62.53 Y8.2 30.25,61.7 29.35,60.8 C42.1
ADCS_IMU1_OSC_32_OUT
  Bottom 0.16: Y10.1 39.95,70.5 40.55,69.9 C36.1
  Bottom 0.2: U15.26 38.85,73.5 39.95,72.4 Y10.1
ADCS_IMU1_OSC_32_OUT1
  Bottom 0.2: U10.26 21.15,73.4 22.25,72.3 Y7.1 22.25,71.6 23.15,70.7 C26.1
ADCS_IMU1_OSC_32_OUT2
  Bottom 0.2: U16.26 31.65,63.6 32.75,62.5 Y8.1 32.75,61.7 33.75,60.7 C28.1
ADCS_JTCK  (via drill 0.3)
  Top 0.16: v49.3,71.3 v49.29,71.31 J3.2
  Bottom 0.16: U12.3 49.3,72.6 U2.49 49.35,71.35 v49.3,71.3
ADCS_JTDI
  Bottom 0.16: U12.2 49.7,73.59 49.84,73.45 U2.50
ADCS_JTDO  (via drill 0.3)
  Top 0.16: v53.43,69.77 57.42,69.77 J3.6
  Bottom 0.16: U2.55 52.36,70.25 52.84,69.77 v53.43,69.77 | U2.55 52.34,73.46 52.6,73.72 U13.2
  Bottom 0.2: U2.55
ADCS_JTMS  (via drill 0.3)
  Top 0.16: J3.4 54.37,72.5 53.23,73.63 v51.38,73.63 51.13,73.63 50.59,74.17 49.53,74.17 v48.22,72.86
  Bottom 0.16: U13.3 52.19,73.88 51.95,73.63 v51.38,73.63 | U2.46 48.06,69.54 48.22,69.7 v48.22,72.86
ADCS_LED  (via drill 0.3)
  Top 0.16: v54.2,57.5 61.95,57.5
  Top 0.2: 61.95,57.5 DS2.A
  Bottom 0.16: U2.21 54.85,60.34 54.22,59.71 54.22,57.52 v54.2,57.5
ADCS_LED_GND  (via drill 0.3)
  Top 0.2: DS2.C 61.86,59.05 61.21,58.4 v59.71,58.4
  Bottom 0.2: R42.1 59.71,59.16 v59.71,58.4
ADCS_OSC_32_IN
  Bottom 0.16: Y2.1 62.85,71.6 C14.1
  Bottom 0.2: 62.85,71.6 61.4,71.6 60.07,70.27 60.07,69.54 59.6,69.07 58.87,69.07 U2.4
ADCS_OSC_32_OUT
  Bottom 0.16: C13.1 62.85,74 Y2.2
  Bottom 0.2: U2.3 59.5,69.54 59.71,69.75 59.71,71.26 62.5,74.05 Y2.2
ADCS_OSC_IN
  Bottom 0.2: Y5.1 63.4,69.2 | 63.4,69.2 64.34,68.25 C1.1 | 63.4,69.2 63.17,69.2 62.27,68.3 60.31,68.3 60.05,68.55 U2.5
ADCS_OSC_OUT  (via drill 0.3)
  Top 0.2: v62.13,66.5 59.43,66.5 v57.87,68.06
  Bottom 0.2: C2.1 62.38,66.75 v62.13,66.5 61.73,66.5 61.04,65.81 Y5.3 | U2.6 58.84,68.06 v57.87,68.06
ADCS_SWD_VSENCE  (via drill 0.3)
  Top 0.2: v47.6,72.36 47.31,72.36 J3.1
  Bottom 0.2: R36.1 47.09,72.36 v47.6,72.36
AGND  (via drill 0.3, 0.35)
  Top 0.2: v26.2,86.8 20.84,86.8 v20.2,86.16 | v73,76.25 72.81,76.45 60.65,76.45 v60.6,76.5
  Route15 0.2: v11.7,16.9 v7.17,16.9 7.17,17.09 7.66,17.58 7.66,20.66 v9.3,22.31 13.5,26.5 v13.5,26.6 16.2,29.3 v20.1,29.3 20.91,29.3 22.8,27.41 v22.8,24.4 39.4,24.4 v39.5,24.5 41.3,22.7 v55.02,22.7 | v88.9,62 88.9,49.6 v86.4,47.1 85.84,47.66 85.84,59.46 v83.3,62 v77.8,62 79.98,64.19 79.98,70.52 v79.9,70.6 | v85.7,70.6 v79.9,70.6 | v79.9,70.6 v74.6,70.6 74.47,70.6 73,72.07 v73,76.25 v73,76.26 73,82.94 v73.7,83.64 72.6,84.75 v72.6,86.1 | v77.61,29.4 87.76,39.55 87.76,45.33 87.28,45.81 v86.4,45.81 | v56.9,24.4 57.5,23.8 v72.54,23.8 72.54,48.85 69,52.4 v68.4,52.4 63.2,47.2 v61.54,47.2 | v34.81,54.1 35.61,54.9 v35.61,64.75 35.61,64.94 36.33,65.67 36.33,67.46 38.88,70.01 38.88,70.59 v42.98,74.69 | v72.6,86.1 71.31,84.81 v71.08,84.81 | v72.6,86.1 72.7,86.2 v74.9,86.2 | v26.2,86.8 26.45,86.55 38.45,86.55 v38.5,86.6 45.01,80.09 v45.01,79.7 48.76,83.45 48.76,85.03 50.53,86.8 v55.55,86.8 55.55,84.59 v56.49,83.64 57.86,82.27 v57.86,81.38 | v57.86,81.38 60.6,78.64 v60.6,76.5 | v57.86,81.38 58.08,81.38 v60.3,83.6
  Bottom 0.2: C86.2 74.15,72.6 74.6,72.15 U21.2 v74.6,70.6 | C85.2 79.45,72.6 79.9,72.15 U20.2 v79.9,70.6 | C87.2 85.25,72.7 85.7,72.25 U28.2 v85.7,70.6 | C82.2 74.35,91.62 73.38,90.64 73.38,89.07 74.9,87.55 U19.2 v74.9,86.2 | 56.71,88.41 57.7,87.43 U14.2 57.88,86.91 57.88,86.57 58.23,86.22 59.07,86.22 60.22,87.37 RN1.4 | 56.71,88.41 56.18,88.95 56.18,90.43 57.15,91.4 C43.2 | C92.2 36.55,86.55 C91.C v38.5,86.6 | 56.71,88.41 55.55,87.25 v55.55,86.8 C34.2 55.55,85.15 54.3,83.9 U8.6 | U26.6 7.4,15.85 6.45,16.8 C64.2 v7.17,16.9 | C70.2 C69.2 6.3,21.75 6.55,21.5 U29.2 8.76,21.5 9.3,22.04 v9.3,22.31 | C84.2 12.25,18.39 10.95,17.09 C65.2 v11.7,16.9 | C94.2 12.25,25.85 C93.C 12.2,26.2 12.6,26.6 v13.5,26.6 | v20.1,29.3 RT5.1 | RT6.1 22.75,24.35 v22.8,24.4 | RT7.1 39.5,23.65 v39.5,24.5 | v86.4,47.1 RT1.1 v86.4,45.81 | v88.9,62 RT10.1 | v83.3,62 RT8.1 | v77.8,62 RT9.1 | v77.61,29.4 RT13.1 78.35,28.63 73.45,23.73 RT4.1 73.25,23.8 v72.54,23.8 | v56.9,24.4 56.9,23.65 RT2.1 56.85,23.4 56.15,22.7 v55.02,22.7 | RT18.1 36.2,65.15 35.8,64.75 v35.61,64.75 | v34.81,54.1 RT14.1 | v45.01,79.7 R2.1 45.75,78.06 43.74,76.05 RT17.1 43.6,75.3 v42.98,74.69 | C71.2 v56.48,83.65 v56.49,83.64 | v60.3,83.6 60.1,83.4 U24.2 | v61.54,47.2 61.48,47.2 60.84,47.85 RT3.1 | RT19.1 67.85,51.83 68.4,52.38 v68.4,52.4 | C66.2 72.65,86.05 v72.6,86.1 | v71.08,84.81 71.08,84.02 U25.6 | C53.2 73.59,83.75 v73.7,83.64 | v73,76.25 73.35,76.6 RT11.1 | RT12.1 19.31,86.16 v20.2,86.16 | RT16.1 26,75.53 26.71,76.24 26.71,77.06 26.09,77.68 26.09,86.69 v26.2,86.8 | C80.2 57.5,82.15 57.86,81.79 v57.86,81.38 | v60.6,76.5 RT15.1
AVDD-0  (via drill 0.3, 0.35)
  Top 0.2: TP1.1 32.58,86.89 v32.8,87.11 | v73.58,79.51 73.2,79.89 62.1,79.89 v61.9,79.69 v57.9,79.69
  Route15 0.2: v86.03,72.8 v80.23,72.8 v75,72.8 75,78.1 v73.58,79.51 75.47,81.4 75.47,88.72 75,89.19 v75,89.23 | v38.6,89.6 v59.4,89.6 61.64,87.36 61.64,81.67 v61.89,81.41 v61.9,81.41 v61.9,79.69 | v57.9,79.69 55.79,79.69 v54.36,81.12 54.84,81.6 v56.5,81.6
  Bottom 0.2: U21.3 75.25,72.2 75.65,72.6 C86.1 v75,72.8 | U20.3 80.55,72.2 80.95,72.6 C85.1 v80.23,72.8 | U28.3 86.35,72.3 86.75,72.7 C87.1 v86.03,72.8 | C82.1 U19.5 75.25,89.81 75,89.56 v75,89.23 | C43.1 U14.5 58.76,89.6 v59.4,89.6 | v32.8,87.11 32.86,87.11 C92.1 FB1.2 36.45,89.45 C91.A v38.6,89.6 | U8.10 54.05,81.85 54.05,81.58 54.36,81.27 v54.36,81.12 | U25.10 72.35,82 72.6,82.25 C53.1 72.9,82.25 73.31,81.84 73.31,79.79 v73.58,79.51 | U24.5 v61.91,81.42 v61.9,81.41 | C80.1 55.9,82.15 | 55.9,82.15 C71.1 | v56.5,81.6 56.45,81.6 55.9,82.15
AVDD-1  (via drill 0.3)
  Top 0.2: v11.3,28.8 10.3,27.8 TP2.1
  Bottom 0.2: U26.10 9.4,16.85 C65.1 9.45,17.09 10.75,18.39 C84.1 10.75,20.41 U29.5 11.63,20.55 15.2,24.11 C93.A 15.2,28.55 FB2.2 C94.1 13.75,28.72 13.16,29.31 11.84,29.31 11.33,28.8 v11.3,28.8
AVREF-0
  Bottom 0.2: 57.71,88.45 56.75,89.41 U14.4 | 57.71,88.45 57.71,92.16 57.56,92.31 56.65,92.31 RN18.10 54.54,90.1 53.88,89.44 51.9,89.44 RN18.5 | RN1.3 60.6,86.43 61.11,86.94 61.11,87.8 60.96,87.95 58.7,87.95 | 57.71,88.45 58.21,87.95 58.7,87.95 | U14.1 58.65,87.9 58.7,87.95
AVREF-1
  Bottom 0.16: 71.83,90.3 73.94,92.41 74.76,92.41 74.91,92.26 74.91,91.07 73.95,90.11 U19.4 73.95,89.44 75.85,87.54 75.85,87.53 | RN2.5 66.66,87.2 68.12,88.66 70.16,88.66 71.73,90.23 RN2.10
  Bottom 0.2: RN2.10 71.83,90.3 | 75.85,87.53 U19.1
AVREF-2  (via drill 0.3)
  Top 0.2: v4.57,12.63 4.57,11.3 7.06,8.81 7.54,8.81 7.56,8.84 v9.12,8.84
  Bottom 0.16: RN3.5 4.06,4.78 5.71,6.43 7.74,6.43 9.14,7.84 RN3.10
  Bottom 0.2: C70.1 C69.1 6.3,20.25 6.6,20.55 U29.1 | U29.1 8.38,20.55 10.28,22.45 U29.4 | RN3.10 9.14,8.82 v9.12,8.84 | U29.1 7.99,19.87 4.57,16.45 v4.57,12.63
BUS_I2C0_IRQ  (via drill 0.3)
  Top 0.16: v34.81,40.06 40.09,40.06 v40.24,40.21 | v30.63,35.59 30.63,34.1 31.34,33.39 31.34,32.09 30.26,31.01 17.09,31.01 10.7,37.4 v6,37.4
  Top 0.45: J4.B45 v6,37.4
  Bottom 0.16: U22.7 47.59,53.23 40.2,45.84 40.2,40.25 v40.24,40.21 | v34.81,40.06 34.3,39.55 34.3,37.56 33.53,36.79 31.79,36.79 U3.61 31.64,36.64 31.05,36.64 30.63,36.21 v30.63,35.59
  Bottom 0.45: J4.B45 v6,37.4
BUS_I2C0_SCL  (via drill 0.3)
  Top 0.16: v6,38.4 6.51,38.91 v30.68,38.91 41.16,38.91 v41.42,39.18
  Top 0.45: J4.B44 v6,38.4
  Bottom 0.16: U3.58 30.86,38.25 30.68,38.44 v30.68,38.91 | U5.6 50.9,54.45 41.42,44.97 v41.42,39.18
  Bottom 0.45: J4.B44 v6,38.4
BUS_I2C0_SDA  (via drill 0.3)
  Top 0.16: v6,39.4 6.12,39.52 v30.13,39.52 40.62,39.52 v40.8,39.7
  Top 0.45: J4.B43 v6,39.4
  Bottom 0.16: U3.59 30.75,37.75 30.14,38.36 v30.14,39.52 v30.13,39.52 | U5.7 50.5,54.5 40.8,44.8 v40.8,39.7
  Bottom 0.45: J4.B43 v6,39.4
BUS_I2C1_IRQ  (via drill 0.3)
  Top 0.16: v15.82,50.39 v6,50.39 v6,50.4
  Top 0.45: J4.B32 v6,50.4
  Bottom 0.16: v15.82,50.39 16.5,49.71 16.5,47.9 16.6,47.8 16.8,47.8 16.9,47.9 16.9,50.6 17,50.7 17.3,50.7 17.4,50.6 17.4,47.9 17.6,47.7 17.8,47.7 18,47.9 18,50.2 18.2,50.4 18.4,50.4 18.6,50.2 18.6,47.9 18.8,47.7 19,47.7 19.2,47.9 19.2,50.2 19.4,50.4 19.6,50.4 19.8,50.2 19.8,46.3 19.95,46.15 20.25,46.15 20.4,46.3 20.4,49 20.6,49.2 20.8,49.2 21,49 21,47.4 21.14,47.26 21.4,47.26 21.6,47.46 21.6,47.9 21.8,48.1 22.05,48.1 22.25,47.9 22.25,46.65 20.6,45 20.6,44.7 20.8,44.5 21.4,44.5 21.5,44.4 21.5,44.1 21.4,44 21.1,44 20.9,43.8 20.9,43.5 21.1,43.3 21.7,43.3 21.8,43.2 21.8,42.9 21.7,42.8 21.5,42.8 21.4,42.7 21.4,41.71 21.61,41.5 22.1,41.5 22.3,41.7 22.3,44.7 U3.33
  Bottom 0.45: J4.B32 v6,50.4
BUS_I2C1_SCL  (via drill 0.3)
  Top 0.16: v21.2,49.6 19.4,51.4 v6,51.4
  Top 0.45: J4.B31 v6,51.4
  Bottom 0.16: v21.2,49.6 22.75,48.05 U3.34 22.75,40.36 23.56,39.55 23.56,35.65 23,35.09 22.55,35.09 19.16,31.7 19.16,14.51 16.95,12.3 U26.15
  Bottom 0.45: J4.B31 v6,51.4
BUS_I2C1_SDA  (via drill 0.3)
  Top 0.45: J4.B30 v6,52.4
  Bottom 0.16: v6,52.4 11.5,52.4 12.21,51.7 12.21,44.7 15.23,41.67 18.91,41.67 18.99,41.75 U3.30 20.91,41.74 23.24,39.41 23.24,35.78 22.87,35.41 22.42,35.41 18.84,31.83 18.84,14.64 17,12.8 U26.14
  Bottom 0.45: J4.B30 v6,52.4
BUS_JTAG_TCK  (via drill 0.3)
  Top 0.16: v6.8,40.1 6.92,39.98 26.91,39.98 29.63,42.69 v37.5,42.69 39.63,44.82 v39.63,46.53 | v56.77,36.23 37.99,36.23 v37.9,36.32
  Bottom 0.16: J4.A46 5.8,36.4 6.8,37.4 v6.8,40.1 | U17.7 v37.5,42.69 37.9,42.29 v37.9,36.32 | U1.14 58.15,36.15 58.07,36.23 v56.77,36.23 | v39.63,46.53 39.63,46.88 43.18,50.43 43.18,73.17 47.95,77.94 49.3,77.94 49.7,77.54 U12.7
BUS_JTAG_TDI  (via drill 0.3)
  Top 0.16: v7.5,40.61 7.82,40.3 26.79,40.3 29.51,43.02 37.06,43.02 v37.5,43.46 39,44.96 v39,45.91 | v57.36,35.66 v38.51,35.66 v38.51,35.65
  Bottom 0.16: U17.6 37.14,43.1 37.28,43.24 v37.5,43.46 37.72,43.24 38.51,42.46 v38.51,35.65 | v7.5,40.61 7.5,36.7 6.2,35.4 J4.A47 | U1.15 v57.37,35.65 v57.36,35.66 | v39,45.91 39.05,45.96 39.87,45.96 43.5,49.6 43.5,73.04 48.08,77.62 49.12,77.62 49.3,77.44 U12.6
BUS_JTAG_TDO  (via drill 0.3)
  Top 0.16: v8.24,40.95 8.57,40.62 26.65,40.62 29.37,43.34 36.6,43.34 37.84,44.57 v37.84,45.06 37.88,45.06 38.37,45.55 v38.37,46.84 | v57.99,35.09 39.19,35.09 v39.1,35
  Bottom 0.16: U18.7 37.3,45.6 v37.84,45.06 39.1,43.8 v39.1,35 | J4.A48 6,34.4 8.24,36.64 v8.24,40.95 | U1.16 58.05,35.15 v57.99,35.09 | v38.37,46.84 38.68,46.84 42.53,50.7 42.53,73.44 47.67,78.58 49.56,78.58 50.23,77.91 52.18,77.91 52.61,77.48 52.61,75.31 52.6,75.31 U13.7
BUS_JTAG_TMS  (via drill 0.3)
  Top 0.16: v37.5,46.16 37.28,45.94 31.52,45.94 26.52,40.94 9.32,40.94 v9.01,41.26 | v56.97,34.52 56.73,34.76 54.76,34.76 54.4,34.4 v39.7,34.4
  Bottom 0.16: U18.6 37.34,46 v37.5,46.16 | v9.01,41.26 9.01,35.91 6.5,33.4 J4.A49 | U1.17 56.95,34.5 v56.97,34.52 | v37.5,46.16 37.72,45.94 39.7,43.96 v39.7,34.4 | v37.5,46.16 38.45,46.16 42.86,50.56 42.86,73.31 47.81,78.26 49.43,78.26 50.1,77.59 52.05,77.59 52.21,77.43 U13.6
BUS_SPI_IFJR_CS  (via drill 0.35)
  Top 0.16: v52.9,23.83 50.98,23.83 50.97,23.83 44.66,23.83 v44.1,24.39 | v44.07,46.81 40.63,46.81 39.74,47.7 31.68,47.7 v31.39,47.99
  Bottom 0.16: v52.9,23.83 52.3,24.43 U27.6 | v44.1,24.39 44.1,46.78 v44.07,46.81 | U3.43 27.26,46.69 28.52,47.95 31.35,47.95 v31.39,47.99
BUS_SPI_MISO  (via drill 0.3)
  Top 0.16: v41.46,37.76 v41.45,37.75 v21.74,37.75 21.43,37.75 21.42,37.75 12.93,37.75 v12.88,37.7 | v41.46,24.95 54.8,24.95 v55.22,25.38
  Top 0.45: J4.B38 v6,44.4
  Bottom 0.16: v6,44.4 10,44.4 10.3,44.1 10.3,38.7 11.29,37.7 v12.88,37.7 | U3.22 v21.73,37.75 v21.74,37.75 | v41.46,37.76 v41.47,37.76 41.47,26.38 v41.47,24.95 v41.46,24.95 | U23.6 55.22,26.93 v55.22,25.38
  Bottom 0.45: v6,44.4 J4.B38
BUS_SPI_MOSI  (via drill 0.3)
  Top 0.16: v40.89,37.19 40.89,37.21 v21.2,37.21 21.13,37.14 v12.3,37.14 | v38.09,25.99 38.16,26.07 v51.66,26.07
  Top 0.45: J4.B39 v6,43.4
  Bottom 0.16: U27.7 51.9,26.3 v51.67,26.07 v51.66,26.07 | v6,43.4 9.58,43.4 9.98,43 9.98,38.57 11.41,37.14 v12.3,37.14 | U3.21 21.16,37.25 v21.2,37.21 | v40.89,37.19 40.89,27.2 39.69,25.99 v38.09,25.99
  Bottom 0.45: v6,43.4 J4.B39
BUS_SPI_SCK  (via drill 0.3)
  Top 0.16: v42.64,38.34 v42.63,38.33 21.24,38.33 v21.2,38.29 21.18,38.27 v12.3,38.27 | v42.04,25.53 54.03,25.53 v54.5,26
  Top 0.45: J4.B37 v6,45.4
  Bottom 0.16: v6,45.4 10.25,45.4 10.82,44.83 10.82,38.63 11.2,38.25 12.28,38.25 v12.3,38.27 | U3.23 21.16,38.25 v21.2,38.29 | v42.64,38.34 42.04,37.74 v42.04,25.53 | v54.5,26 54.8,26.3 U23.7
  Bottom 0.45: J4.B37 v6,45.4
C&DH_ADC_DCAP
  Bottom 0.16: C88.1 7.85,18.4 8.52,17.73 8.52,15.81 8.4,15.7 U26.8
C&DH_ADC_VREF  (via drill 0.3)
  Top 0.16: v7.08,17.82 7.08,22.32
  Top 0.2: 7.08,22.32 v7,22.4
  Bottom 0.16: 7.94,22.4 v7,22.4 | v7.08,17.82 7.19,17.82 7.95,17.06 C64.1 7.9,16.85 U26.7
  Bottom 0.2: U29.3 7.94,22.4
CHASSIS  (via drill 0.3)
  Top 0.2: J4.CHASSIS@4 v46.2,3.38
  Bottom 0.2: R3.1 26.8,91.7 28.31,93.21 49.41,93.21 J4.CHASSIS@2 88,94 90,92 90,3.9 87.9,1.8 J4.CHASSIS@4 v46.2,3.38
  other vias: 50.2,94
COIL-X_!SLEEP  (via drill 0.3)
  Top 0.16: v81.2,59.4 76.8,55 52.85,55
  Top 0.2: 52.85,55 v52.17,55.67
  Bottom 0.16: U30.7 80.65,61.9 81.17,61.38 81.17,59.43 v81.2,59.4 | U2.27 51.85,60.32 52.35,59.82 52.35,55.85 v52.17,55.67
COIL-X_COIL+  (via drill 0.3)
  Top 0.16: J5.3 25.14,84.51 43.04,84.51 46.99,80.56 77.25,80.56 v77.39,80.42
  Bottom 0.16: v77.39,80.42 77.39,78.1 77.83,77.66 77.83,68.43 79.15,67.11 80.23,67.11 80.69,66.65 80.69,65.55 80.65,65.51 U30.2
COIL-X_COIL-  (via drill 0.3)
  Top 0.16: J5.4 25.1,83.05 44.05,83.05 46.86,80.23 76.81,80.23 77.42,79.63 v77.94,79.63
  Bottom 0.16: U20.5 79.9,68.35 79.55,68 R29.2 79.22,67.8 78.16,68.87 78.16,79.41 v77.94,79.63
COIL-X_CURRENT  (via drill 0.3)
  Top 0.16: v47.59,83.63 47.69,83.53 47.7,83.53 48.45,82.78 56.99,82.78 57.13,82.63 77.86,82.63 v78.2,82.3
  Bottom 0.16: U8.18 49.4,82.9 49.19,83.11 49.19,83.65 49.05,83.79 47.75,83.79 v47.59,83.63 | U20.6 78.8,69.35 78.47,69.67 78.47,82.03 v78.2,82.3
COIL-X_IN1  (via drill 0.3)
  Top 0.16: v81.75,59.99 81.68,59.99 81.23,60.45 59.81,60.45 v59.76,60.5
  Bottom 0.16: U30.6 81.15,61.88 81.73,61.3 81.73,60.02 v81.75,59.99 | U2.16 59.35,63.05 59.76,62.64 v59.76,60.5
COIL-X_IN2  (via drill 0.3)
  Top 0.16: v82.36,59.45 77.32,54.41 v57.39,54.41
  Bottom 0.16: U30.5 81.65,62.15 82.36,61.45 v82.36,59.45 | U2.17 56.85,60.3 57.39,59.76 v57.39,54.41
COIL-X_OUT2
  Bottom 0.16: U20.4 80.55,68.4 81.05,67.9 R29.1 81.11,67.74 81.11,65.54 81.16,65.49 U30.3
COIL-Y_!SLEEP  (via drill 0.3)
  Top 0.16: v75.7,59.3 73.3,56.9 v54.78,56.9
  Bottom 0.16: U6.7 75.14,61.91 75.7,61.36 v75.7,59.3 | U2.20 55.36,60.34 54.78,59.76 v54.78,56.9
  Bottom 0.2: U6.7 | U2.20
COIL-Y_COIL+  (via drill 0.3)
  Top 0.16: J11.3 47.7,9.15 49.76,7.09 83.45,7.09 83.84,7.48 87.87,7.48 89.38,8.99 89.38,60.27 85.5,64.15 80.83,64.15 79.8,65.19 v77.05,65.19 v75.08,65.19 v75.07,65.19 | J15.3 45.7,84.75 47.99,82.46 56.86,82.46 57,82.31 76.84,82.31 v77.34,81.81
  Bottom 0.16: U6.2 75.15,65.11 v75.07,65.19 | v77.34,81.81 77.34,81.14 76.75,80.56 76.75,65.48 v77.05,65.19
COIL-Y_COIL-  (via drill 0.3)
  Top 0.16: J11.4 47.7,7.65 48.64,6.71 83.52,6.71 83.97,7.16 88.02,7.16 89.7,8.84 89.7,60.41 85.56,64.54 85.56,66.33 85.2,66.7 73.9,66.7 v73.7,66.9 | J15.4 45.72,83.25 46.83,82.14 56.72,82.14 56.87,82 75.92,82 v76.64,81.28
  Bottom 0.16: v73.7,66.9 73.9,66.9 74.15,67.15 R30.2 74.15,67.9 74.6,68.35 U21.5 74.6,69.49 76.42,71.31 76.42,81.06 v76.64,81.28
COIL-Y_CURRENT  (via drill 0.3)
  Top 0.16: v47.58,84.39 47.8,84.17 47.81,84.17 48.88,83.1 57.12,83.1 57.27,82.95 76.03,82.95 v76.31,83.24
  Bottom 0.16: v47.58,84.39 v47.58,84.38 47.85,84.11 49.18,84.11 49.51,83.78 49.51,83.5 49.61,83.4 U8.19 | v76.31,83.24 76.09,83.02 76.09,77.66 73.31,74.87 73.31,69.99 U21.6
COIL-Y_IN1  (via drill 0.3)
  Top 0.16: v76.28,59.86 76.28,59.06 73.77,56.54 60.92,56.54 v60.7,56.31
  Bottom 0.16: U6.6 75.64,61.91 76.28,61.27 v76.28,59.86 | U2.14 59.66,64.06 60.7,63.02 v60.7,56.31
  Bottom 0.2: U6.6 | U2.14
COIL-Y_IN2  (via drill 0.3)
  Top 0.16: v76.89,59.31 76.89,59.15 73.42,55.69 v60.09,55.69
  Bottom 0.16: U6.5 76.15,62.15 76.89,61.41 v76.89,59.31 | U2.15 59.66,63.55 60.34,62.87 60.34,56.78 60.12,56.56 60.12,55.71 v60.09,55.69
COIL-Y_OUT2
  Bottom 0.16: U21.4 75.25,68.4 75.65,68 R30.1 75.61,67.76 75.61,64.49 U6.3
COIL-Z_!SLEEP  (via drill 0.3)
  Top 0.16: v86.97,60.75 86.97,61.17 84.95,63.19 51.23,63.19 v50.43,63.99
  Bottom 0.16: U7.7 86.25,61.91 86.97,61.19 v86.97,60.75 | v50.43,63.99 50.38,64.04 50.38,67.14 48.47,69.06 U2.45
  Bottom 0.2: U2.45
COIL-Z_COIL+  (via drill 0.3)
  Top 0.16: J12.3 24.8,9.15 24.2,8.55 24.2,7.15 25.29,6.06 87.39,6.06 90.02,8.69 90.02,61.7 90.02,63.89 89.95,63.95 88.73,65.18 v86.17,65.18
  Bottom 0.16: U7.2 86.25,65.1 v86.17,65.18
COIL-Z_COIL-  (via drill 0.3 pad 0.55)
  Top 0.16: J12.4 25.2,7.65 26.46,6.39 84.05,6.39 v84.27,6.61
  Bottom 0.16: U28.5 85.7,68.35 85.25,67.9 R31.2 85.25,67.15 84.36,66.26 84.36,58.59 87.74,55.21 87.74,39.74 84.27,36.27 v84.27,6.61
COIL-Z_CURRENT  (via drill 0.3)
  Top 0.16: v49.97,84.38 50.01,84.38 50.13,84.26 84.44,84.26 v84.67,84.5
  Bottom 0.16: U8.20 50.2,84.16 v49.97,84.38 | v84.67,84.5 84.44,84.27 84.44,69.95 U28.6
COIL-Z_IN1  (via drill 0.3)
  Top 0.16: v87.55,60.25 87.55,61.05 85.09,63.51 51.68,63.51 50.66,64.53 v49.22,64.53
  Bottom 0.16: U7.6 86.75,61.9 87.55,61.1 v87.55,60.25 | U2.41 48.26,67.06 49.21,66.11 v49.21,64.54 v49.22,64.53
  Bottom 0.2: U7.6 | U2.41
COIL-Z_IN2  (via drill 0.3)
  Top 0.16: v88.16,60.72 88.16,60.89 85.22,63.83 51.82,63.83 50.55,65.1 v49.8,65.1
  Bottom 0.16: U7.5 87.25,62.15 88.16,61.24 v88.16,60.72 | U2.44 48.46,68.56 49.8,67.22 v49.8,65.1
  Bottom 0.2: U2.44
COIL-Z_OUT2
  Bottom 0.16: R31.1 86.75,67.9 86.35,68.3 U28.4 | 86.71,67.76 86.71,65.29 86.75,65.25 U7.3
  Bottom 0.2: 86.71,67.76 R31.1
COM_SPI_CS  (via drill 0.3)
  Top 0.16: v6,46.4 6.3,46.4 6.7,46.8 19.26,46.8 24.1,41.96 25.75,41.96 v25.79,41.91
  Top 0.45: J4.A36 v6,46.4
  Bottom 0.16: v25.79,41.91 25.75,41.88 U3.9
  Bottom 0.45: J4.A36 v6,46.4
COM_SPI_MISO  (via drill 0.3)
  Top 0.16: v6,48.4 6.46,47.93 10.93,47.93 11.4,48.4 18.89,48.4 23.89,43.39 24.89,43.39 v25.29,42.99
  Top 0.45: J4.B34 v6,48.4
  Bottom 0.16: U3.10 25.25,42.95 v25.29,42.99
  Bottom 0.45: J4.B34 v6,48.4
COM_SPI_MOSI  (via drill 0.3)
  Top 0.16: v6,47.4 6.46,47.4 6.65,47.21 19.59,47.21 24.3,42.5 v24.71,42.5
  Top 0.45: J4.B35 v6,47.4
  Bottom 0.16: U3.11 24.75,42.46 v24.71,42.5
  Bottom 0.45: J4.B35 v6,47.4
COM_SPI_SCK  (via drill 0.3)
  Top 0.45: J4.B33 v6,49.4
  Bottom 0.16: v6,49.4 11.18,49.4 11.87,48.71 11.87,44.58 15.3,41.15 15.6,41.15 16.65,40.1 16.8,40.1 16.9,40.2 16.9,41 17.1,41.2 17.4,41.2 17.6,41 17.6,39.4 17.8,39.2 18,39.2 18.2,39.4 18.2,41.1 18.35,41.25 U3.29
  Bottom 0.45: J4.B33 v6,49.4
CTRL_SYNC  (via drill 0.3)
  Top 0.16: v67.02,28.58 60.92,28.58 57.5,32 v52.4,32 47.21,32 44.55,29.34 v34.63,29.34 | v27,42.2 26.16,41.36 9.67,41.36 9.23,41.8 7.4,41.8 v6,40.4
  Top 0.45: J4.B42 v6,40.4
  Bottom 0.16: U2.11 58.74,65.44 58.15,65.44 58.01,65.3 58.01,62.8 58.79,62.02 58.79,50.85 62.14,47.5 66.3,47.5 67.04,46.76 67.04,28.6 v67.02,28.58 | U1.26 52.45,32.05 v52.4,32 | v34.63,29.34 34.63,31.65 33.84,32.45 32.28,32.45 30.64,34.09 28.77,34.09 26.33,36.53 26.33,42.2 | U3.39 25.25,43.8 26.33,42.72 26.33,42.2 | 26.33,42.2 v27,42.2